# Altium project AWH6_V10.PrjPcb (part 2 of 3)

## Sheet TF-USB.SchDoc
size A3; SheetNumber: 9; SheetTotal: 10
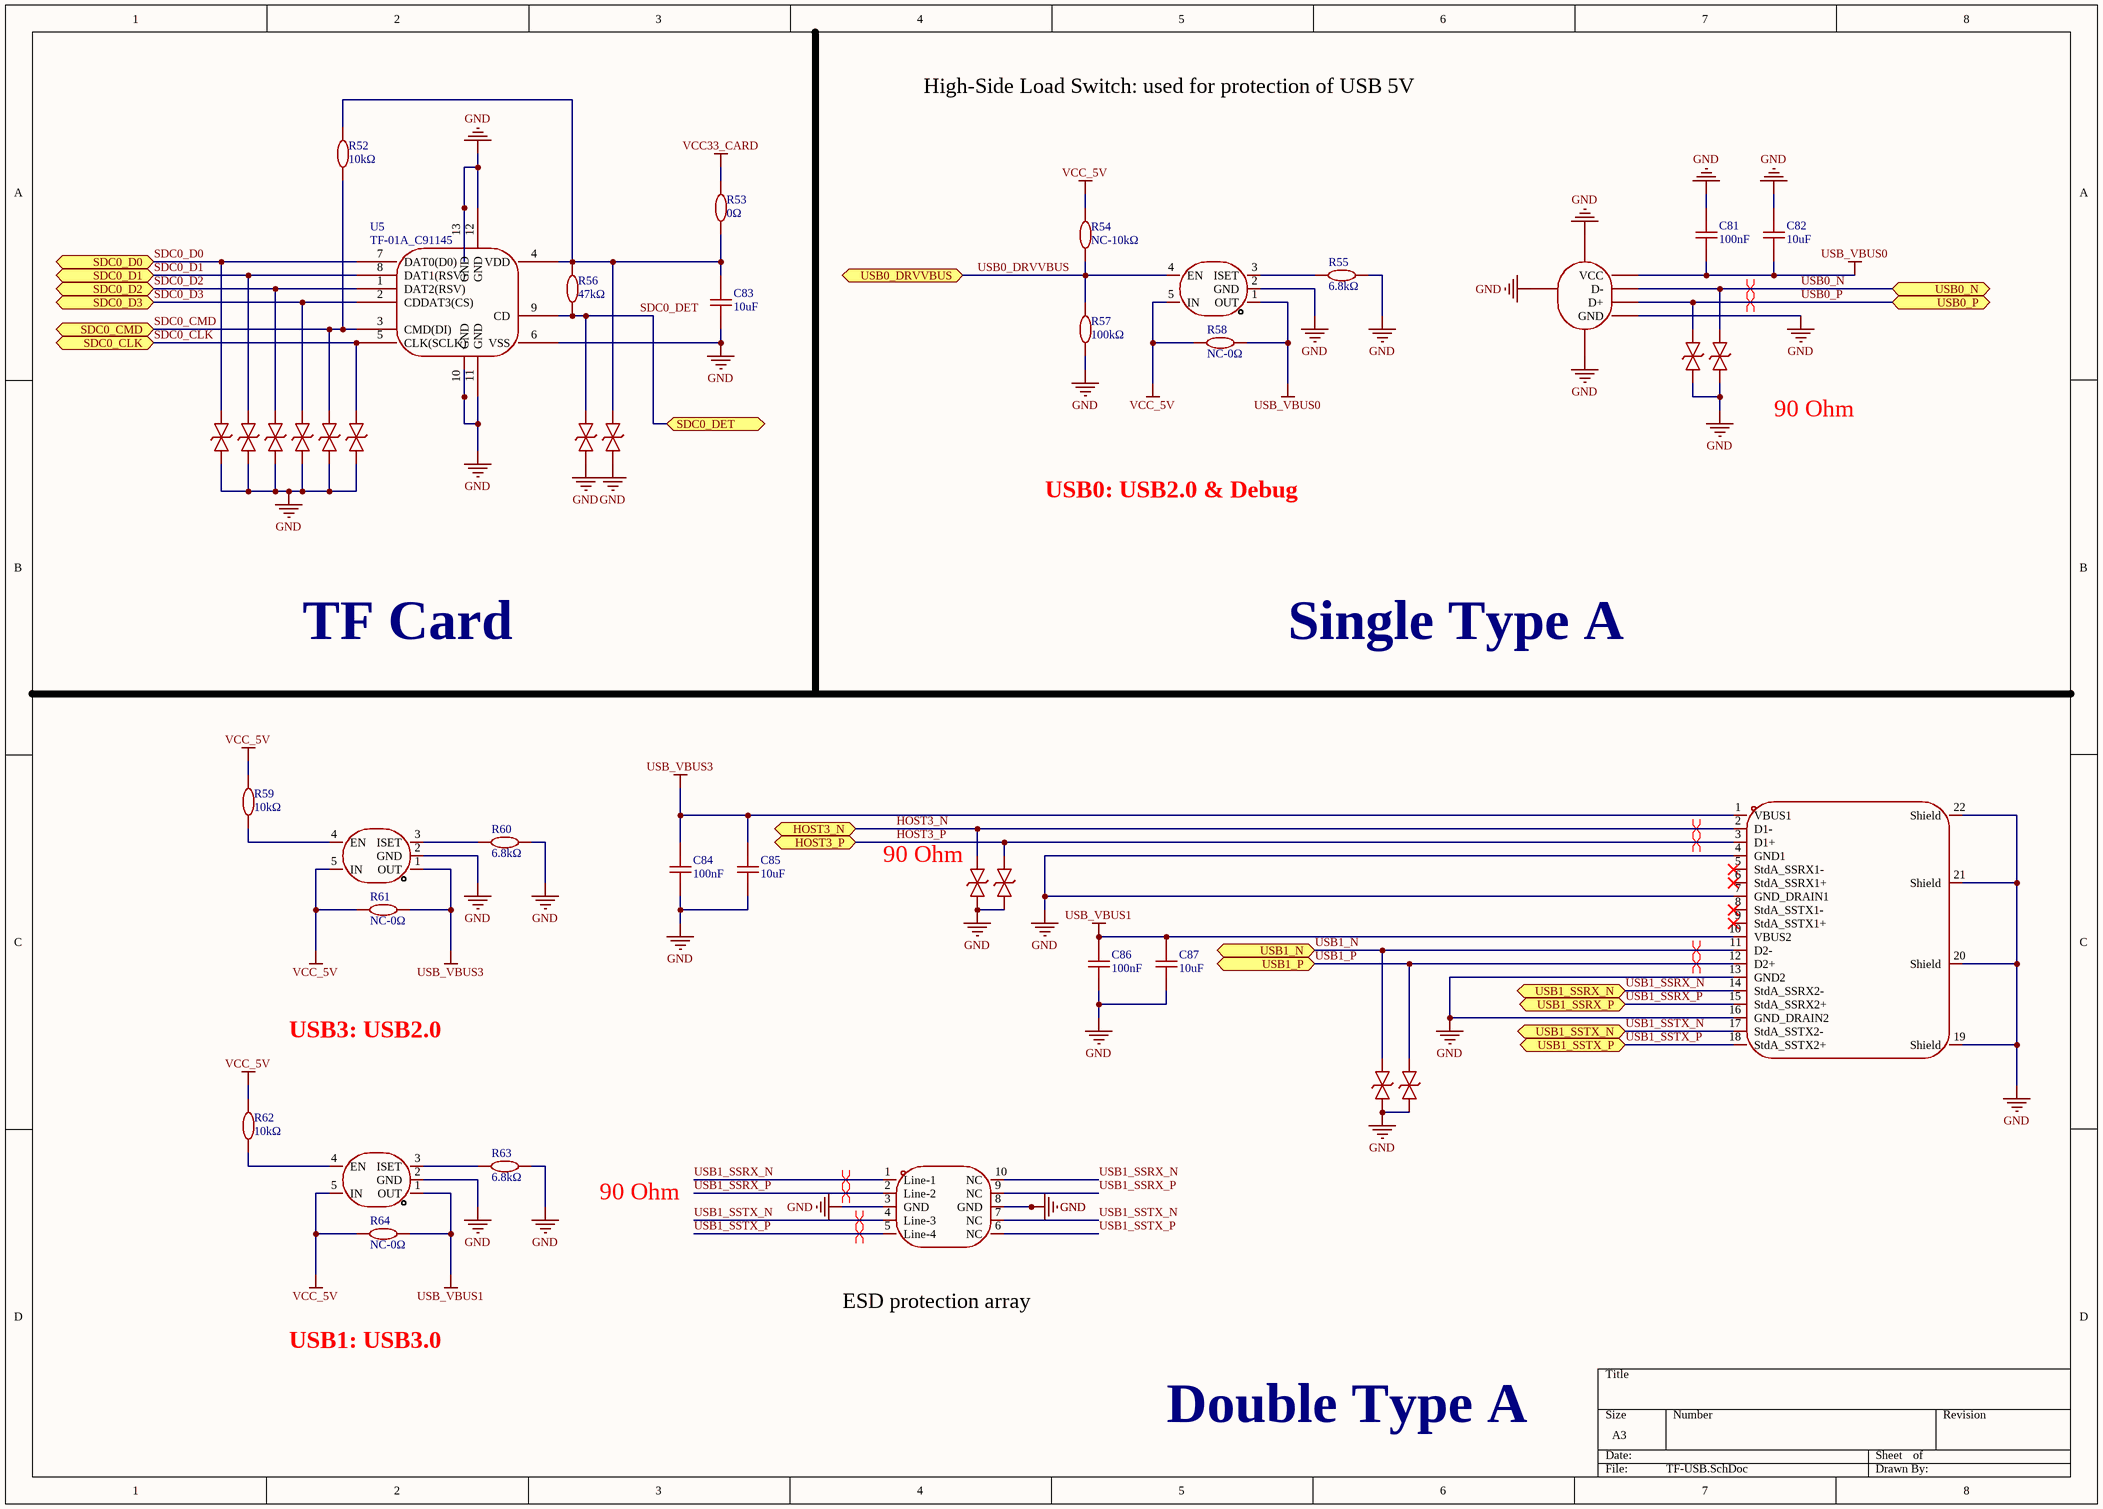
[diagram p5: TF-USB.SchDoc]

### Parts
C81  100nF  [C0402]
C82  10uF  [C0603]
C83  10uF  [C0603]
C84  100nF  [C0402]
C85  10uF  [C0603]
C86  100nF  [C0402]
C87  10uF  [C0603]
D6  AZ1045-04F.R7G  [DFN2510-10_L2.5-W1.0-P0.50-BL]  (value not drawn)
R52  10kΩ  [R0402]
R53  0Ω  [R0402]
R54  NC-10kΩ  [R0402]
R55  6.8kΩ  [R0402]
R56  47kΩ  [R0402]
R57  100kΩ  [R0402]
R58  NC-0Ω  [R0402]
R59  10kΩ  [R0402]
R60  6.8kΩ  [R0402]
R61  NC-0Ω  [R0402]
R62  10kΩ  [R0402]
R63  6.8kΩ  [R0402]
R64  NC-0Ω  [R0402]
U5  TF-01A_C91145  [TF-SMD_TF-01A]
U13  SY6280AAC  [SOT-23-5_L3.0-W1.7-P0.95-LS2.8-BL]  (value not drawn)
U14  ESD5451N  [DFN1006-2L-BI]  (value not drawn)
U15  ESD5451N  [DFN1006-2L-BI]  (value not drawn)
U16  ESD5451N  [DFN1006-2L-BI]  (value not drawn)
U17  ESD5451N  [DFN1006-2L-BI]  (value not drawn)
U18  ESD5451N  [DFN1006-2L-BI]  (value not drawn)
U19  ESD5451N  [DFN1006-2L-BI]  (value not drawn)
U20  ESD5451N  [DFN1006-2L-BI]  (value not drawn)
U21  ESD5451N  [DFN1006-2L-BI]  (value not drawn)
U22  ESD5451N  [DFN1006-2L-BI]  (value not drawn)
U23  ESD5451N  [DFN1006-2L-BI]  (value not drawn)
U24  ESD5451N  [DFN1006-2L-BI]  (value not drawn)
U25  ESD5451N  [DFN1006-2L-BI]  (value not drawn)
U26  SY6280AAC  [SOT-23-5_L3.0-W1.7-P0.95-LS2.8-BL]  (value not drawn)
U27  ESD5451N  [DFN1006-2L-BI]  (value not drawn)
U28  ESD5451N  [DFN1006-2L-BI]  (value not drawn)
U29  SY6280AAC  [SOT-23-5_L3.0-W1.7-P0.95-LS2.8-BL]  (value not drawn)
USB1  USB-303WSD-BRY  [USB-A-TH_XUNPU_USB-303WSD-BRY]  (value not drawn)
USB2  906-162A1011D10200  [USB-A-TH_4P-P1.40-V-F-C39416]  (value not drawn)

### Ports
HOST3_N (bidir, see SoC_2[2A]), HOST3_P (bidir, see SoC_2[2A]), SDC0_CLK (bidir, see SoC_1[7A]), SDC0_CMD (bidir, see SoC_1[6A]), SDC0_D0 (bidir, see SoC_1[6A]), SDC0_D1 (bidir, see SoC_1[6A]), SDC0_D2 (bidir, see SoC_1[6A]), SDC0_D3 (bidir, see SoC_1[6A]), SDC0_DET (bidir, see SoC_1[6A]), USB0_DRVVBUS (bidir, see SoC_1[6C]), USB0_N (bidir, see SoC_2[2A]), USB0_P (bidir, see SoC_2[2A]), USB1_N (bidir, see SoC_2[2A]), USB1_P (bidir, see SoC_2[2A]), USB1_SSRX_N (bidir, see SoC_2[2A]), USB1_SSRX_P (bidir, see SoC_2[2A]), USB1_SSTX_N (bidir, see SoC_2[1A]), USB1_SSTX_P (bidir, see SoC_2[1A])

### Nets
GND: C81.2 C82.2 C83.1 C84.1 C85.1 C86.1 C87.1 D6.3(GND) D6.8(GND) R55.2 R57.1 R60.2 R63.2 U5.6(VSS) U5.10(GND) U5.11(GND) U5.12(GND) U5.13(GND) U13.2(GND) U14.1 U15.1 U16.1 U17.1 U18.1 U19.1 U20.1 U21.1 U22.1 U23.1 U24.1 U25.1 U26.2(GND) U27.1 U28.1 U29.2(GND) USB1.4(GND1) USB1.7(GND_DRAIN1) USB1.13(GND2) USB1.16(GND_DRAIN2) USB1.19(Shield) USB1.20(Shield) USB1.21(Shield) USB1.22(Shield) USB2.4(GND) USB2.5 USB2.6 USB2.7
USB_VBUS0: C81.1 C82.1 R58.1 U13.1(OUT) USB2.1(VCC)
USB_VBUS1: C86.2 C87.2 R64.1 U29.1(OUT) USB1.10(VBUS2)
USB_VBUS3: C84.2 C85.2 R61.1 U26.1(OUT) USB1.1(VBUS1)
VCC33_CARD: R53.2  [project net ALDO3]
VCC_5V: R54.2 R58.2 R59.2 R61.2 R62.2 R64.2 U13.5(IN) U26.5(IN) U29.5(IN)  [project net PS]
HOST3_N: U24.2 USB1.2(D1-) ; port HOST3_N
HOST3_P: U25.2 USB1.3(D1+) ; port HOST3_P
SDC0_CLK: U5.5(CLK(SCLK)) U21.2 ; port SDC0_CLK
SDC0_CMD: R52.1 U5.3(CMD(DI)) U20.2 ; port SDC0_CMD
SDC0_D0: U5.7(DAT0(D0)) U16.2 ; port SDC0_D0
SDC0_D1: U5.8(DAT1(RSV)) U17.2 ; port SDC0_D1
SDC0_D2: U5.1(DAT2(RSV)) U18.2 ; port SDC0_D2
SDC0_D3: U5.2(CDDAT3(CS)) U19.2 ; port SDC0_D3
SDC0_DET: R56.1 U5.9(CD) U22.2 ; port SDC0_DET
USB0_DRVVBUS: R54.1 R57.2 U13.4(EN) ; port USB0_DRVVBUS
USB0_N: U15.2 USB2.2(D-) ; port USB0_N
USB0_P: U14.2 USB2.3(D+) ; port USB0_P
USB1_N: U27.2 USB1.11(D2-) ; port USB1_N
USB1_P: U28.2 USB1.12(D2+) ; port USB1_P
USB1_SSRX_N: D6.1(Line-1) D6.10(NC) USB1.14(StdA_SSRX2-) ; port USB1_SSRX_N
USB1_SSRX_P: D6.2(Line-2) D6.9(NC) USB1.15(StdA_SSRX2+) ; port USB1_SSRX_P
USB1_SSTX_N: D6.4(Line-3) D6.7(NC) USB1.17(StdA_SSTX2-) ; port USB1_SSTX_N
USB1_SSTX_P: D6.5(Line-4) D6.6(NC) USB1.18(StdA_SSTX2+) ; port USB1_SSTX_P
NetC83_2: C83.2 R52.2 R53.1 R56.2 U5.4(VDD) U23.2
NetR55_1: R55.1 U13.3(ISET)
NetR59_1: R59.1 U26.4(EN)
NetR60_1: R60.1 U26.3(ISET)
NetR62_1: R62.1 U29.4(EN)
NetR63_1: R63.1 U29.3(ISET)

Not connected (* = marked no-connect by the designer): USB1 5(StdA_SSRX1-)* 6(StdA_SSRX1+)* 8(StdA_SSTX1-)* 9(StdA_SSTX1+)*

### Layout directives
differential pair: HOST3_N, HOST3_P, USB0_N, USB0_P, USB1_N, USB1_P, USB1_SSRX_N, USB1_SSRX_P, USB1_SSTX_N, USB1_SSTX_P

### Notes on the sheet
- High-Side Load Switch: used for protection of USB 5V
- 90 Ohm
- USB0: USB2.0 & Debug
- TF Card
- Single Type A
- (near U24) 90 Ohm
- USB3: USB2.0
- ESD protection array
- USB1: USB3.0
- Double Type A

### Library data of the parts
C81 C84 C86 = 100nF: 50V 100nF X7R ±10% 0402 Ceramic Capacitors ROHS
C82 C83 C85 C87 = 10uF: 10V 10uF X5R ±10% 0603 Ceramic Capacitors ROHS
D6 = AZ1045-04F.R7G: 3.5A@8/20us 30W@8/20us 12V 6V 5V DFN2510-10 TVS Diodes ROHS; Manufacturer: AMAZING(晶焱); Add into BOM: yes; Reverse Leakage Current (Ir): 1.5uA; Number of Channels: 4; level of protection: IEC 61000-4-5；IEC 61000-4-2; Type: ESD; Junction Capacitance: 0.5pF; Symbol: AZ1045-04F.R7G; Device: AZ1045-04F.R7G; LCSC Part Name: ESD 5V截止 峰值脉冲电流：3.5A@8/20us; Supplier Part: C356811; Manufacturer Part: AZ1045-04F.R7G; Supplier Footprint: DFN2510-10; JLCPCB Part Class: Extended Part; Datasheet: https://item.szlcsc.com/datasheet/AZ1045-04F.R7G/331915.html; Supplier: LCSC; Convert to PCB: yes; Reverse Stand-Off Voltage (Vrwm): 5V; Clamping Voltage: 12V; Peak Pulse Current (Ipp): 3.5A@8/20us; Peak Pulse Power Dissipation (Ppp): 30W@8/20us; Voltage - Breakdown: 6V
R52 R54 R59 R62 = 10kΩ: 62.5mW 10kΩ 50V ±100ppm/℃ Thick Film Resistor ±1% 0402 Chip Resistor - Surface Mount ROHS
R53 R58 R61 R64 = 0Ω: 0Ω 62.5mW 50V Thick Film Resistor ±1% 0402 Chip Resistor - Surface Mount ROHS
R55 R60 R63 = 6.8kΩ: 62.5mW 6.8kΩ 50V ±100ppm/℃ Thick Film Resistor ±1% 0402 Chip Resistor - Surface Mount ROHS
R56 = 47kΩ: 62.5mW 47kΩ 50V ±100ppm/℃ Thick Film Resistor ±1% 0402 Chip Resistor - Surface Mount ROHS
R57 = 100kΩ: 100kΩ 62.5mW 50V ±100ppm/℃ Thick Film Resistor ±1% 0402 Chip Resistor - Surface Mount ROHS
U5 = TF-01A_C91145: Push-Push 1.85mm Connector and Ejector MicroSD Card (TF Card) SMD PC Card Sockets ROHS
U13 U26 U29 = SY6280AAC_C55136: 1 Active High High Side Switch SOT-23-5 Power Distribution Switches, Load Drivers ROHS; Manufacturer: Silergy(矽力杰); Add into BOM: yes; Number of Channels: 1; Voltage - Supply: 2.4V~5.5V; RDS(on): 80mΩ; Symbol: SY6280AAC; Device: SY6280AAC_C55136; LCSC Part Name: SY6280AAC; Supplier Part: C55136; Manufacturer Part: SY6280AAC; Supplier Footprint: SOT-23-5; JLCPCB Part Class: Extended Part; Datasheet: https://item.szlcsc.com/datasheet/SY6280AAC/56162.html; Supplier: LCSC; Convert to PCB: yes; Type: High Side Switch; Control Input Logic: Active High; Operating Temperature	-: -40℃~+125℃; Features: Over Temperature Protection；Overcurrent Protection(OCP)
U14-U25 U27 U28 = ESD5451N_C5261080: 9A 9.8V 8V Bidirectional 5V DFN1006-2L TVS Diodes ROHS; Manufacturer: HXY MOSFET(华轩阳电子); Add into BOM: yes; Reverse Leakage Current (Ir): 500nA; Number of Channels: 1.0; level of protection: IEC 61000-4-2; Junction Capacitance: 15pF; Symbol: ESD5451N_C5261080; Device: ESD5451N_C5261080; LCSC Part Name: 5V 15pF 双向; Supplier Part: C5261080; Manufacturer Part: ESD5451N; Supplier Footprint: DFN1006-2L; JLCPCB Part Class: Extended Part; Datasheet: https://item.szlcsc.com/datasheet/ESD5451N/5983779.html; Supplier: LCSC; Convert to PCB: yes; Polarity: Bidirectional; Reverse Stand-Off Voltage (Vrwm): 5V; Clamping Voltage: 9.8V; Peak Pulse Current (Ipp): 9A; Voltage - Breakdown: 8V; Type: ESD
USB1 = USB-303WSD-BRY: USB 3.0 2 9Px2 -30℃~+85℃ Type-A Through Hole,Right Angle USB, DVI, HDMI Connector Assemblies ROHS; Manufacturer: XUNPU(讯普); Add into BOM: yes; Protocol Standard: USB 3.0; Gender: Female; Number of Ports: 2; Current Rating-Power: 1.8A; Voltage Rating: 30V; Detection color: Blue; Symbol: USB-303WSD-BRY; Device: USB-303WSD-BRY; Supplier Part: C2895028; Manufacturer Part: USB-303WSD-BRY; Supplier Footprint: 插件; JLCPCB Part Class: Extended Part; Datasheet: https://item.szlcsc.com/datasheet/USB-303WSD-BRY/3132965.html; Supplier: LCSC; Convert to PCB: yes; Connector Type: Type-A; Mounting Type: Right Angle; Number of Contacts: 9Px2; Length: -; Operating Temperature: -30℃~+85℃; LCSC Part Name: Type-A 母 弯插
USB2 = 906-162A1011D10200: USB 2.0 1 4P Type-A Through Hole USB, DVI, HDMI Connector Assemblies ROHS; Manufacturer: 精拓金; Symbol: AFSide of the three straight feet boundless copper14.0PBTWhite plastic90degree; Add into BOM: yes; Protocol Standard: USB 2.0; Gender: Female; Number of Ports: 1; Current Rating-Power: 2A; Device: 906-162A1011D10200; LCSC Part Name: Type-A 母 侧插; Supplier Part: C39417; Manufacturer Part: 906-162A1011D10200; Supplier Footprint: 插件; JLCPCB Part Class: Extended Part; Datasheet: https://item.szlcsc.com/datasheet/906-162A1011D10200/40400.html; Supplier: LCSC; Convert to PCB: yes; Connector Type: Type-A; Mounting Type: Vertical, Flag; Number of Contacts: 4P; Operating Temperature: -

## Sheet Audio-HDMI.SchDoc
size A3; SheetNumber: 3; SheetTotal: 10
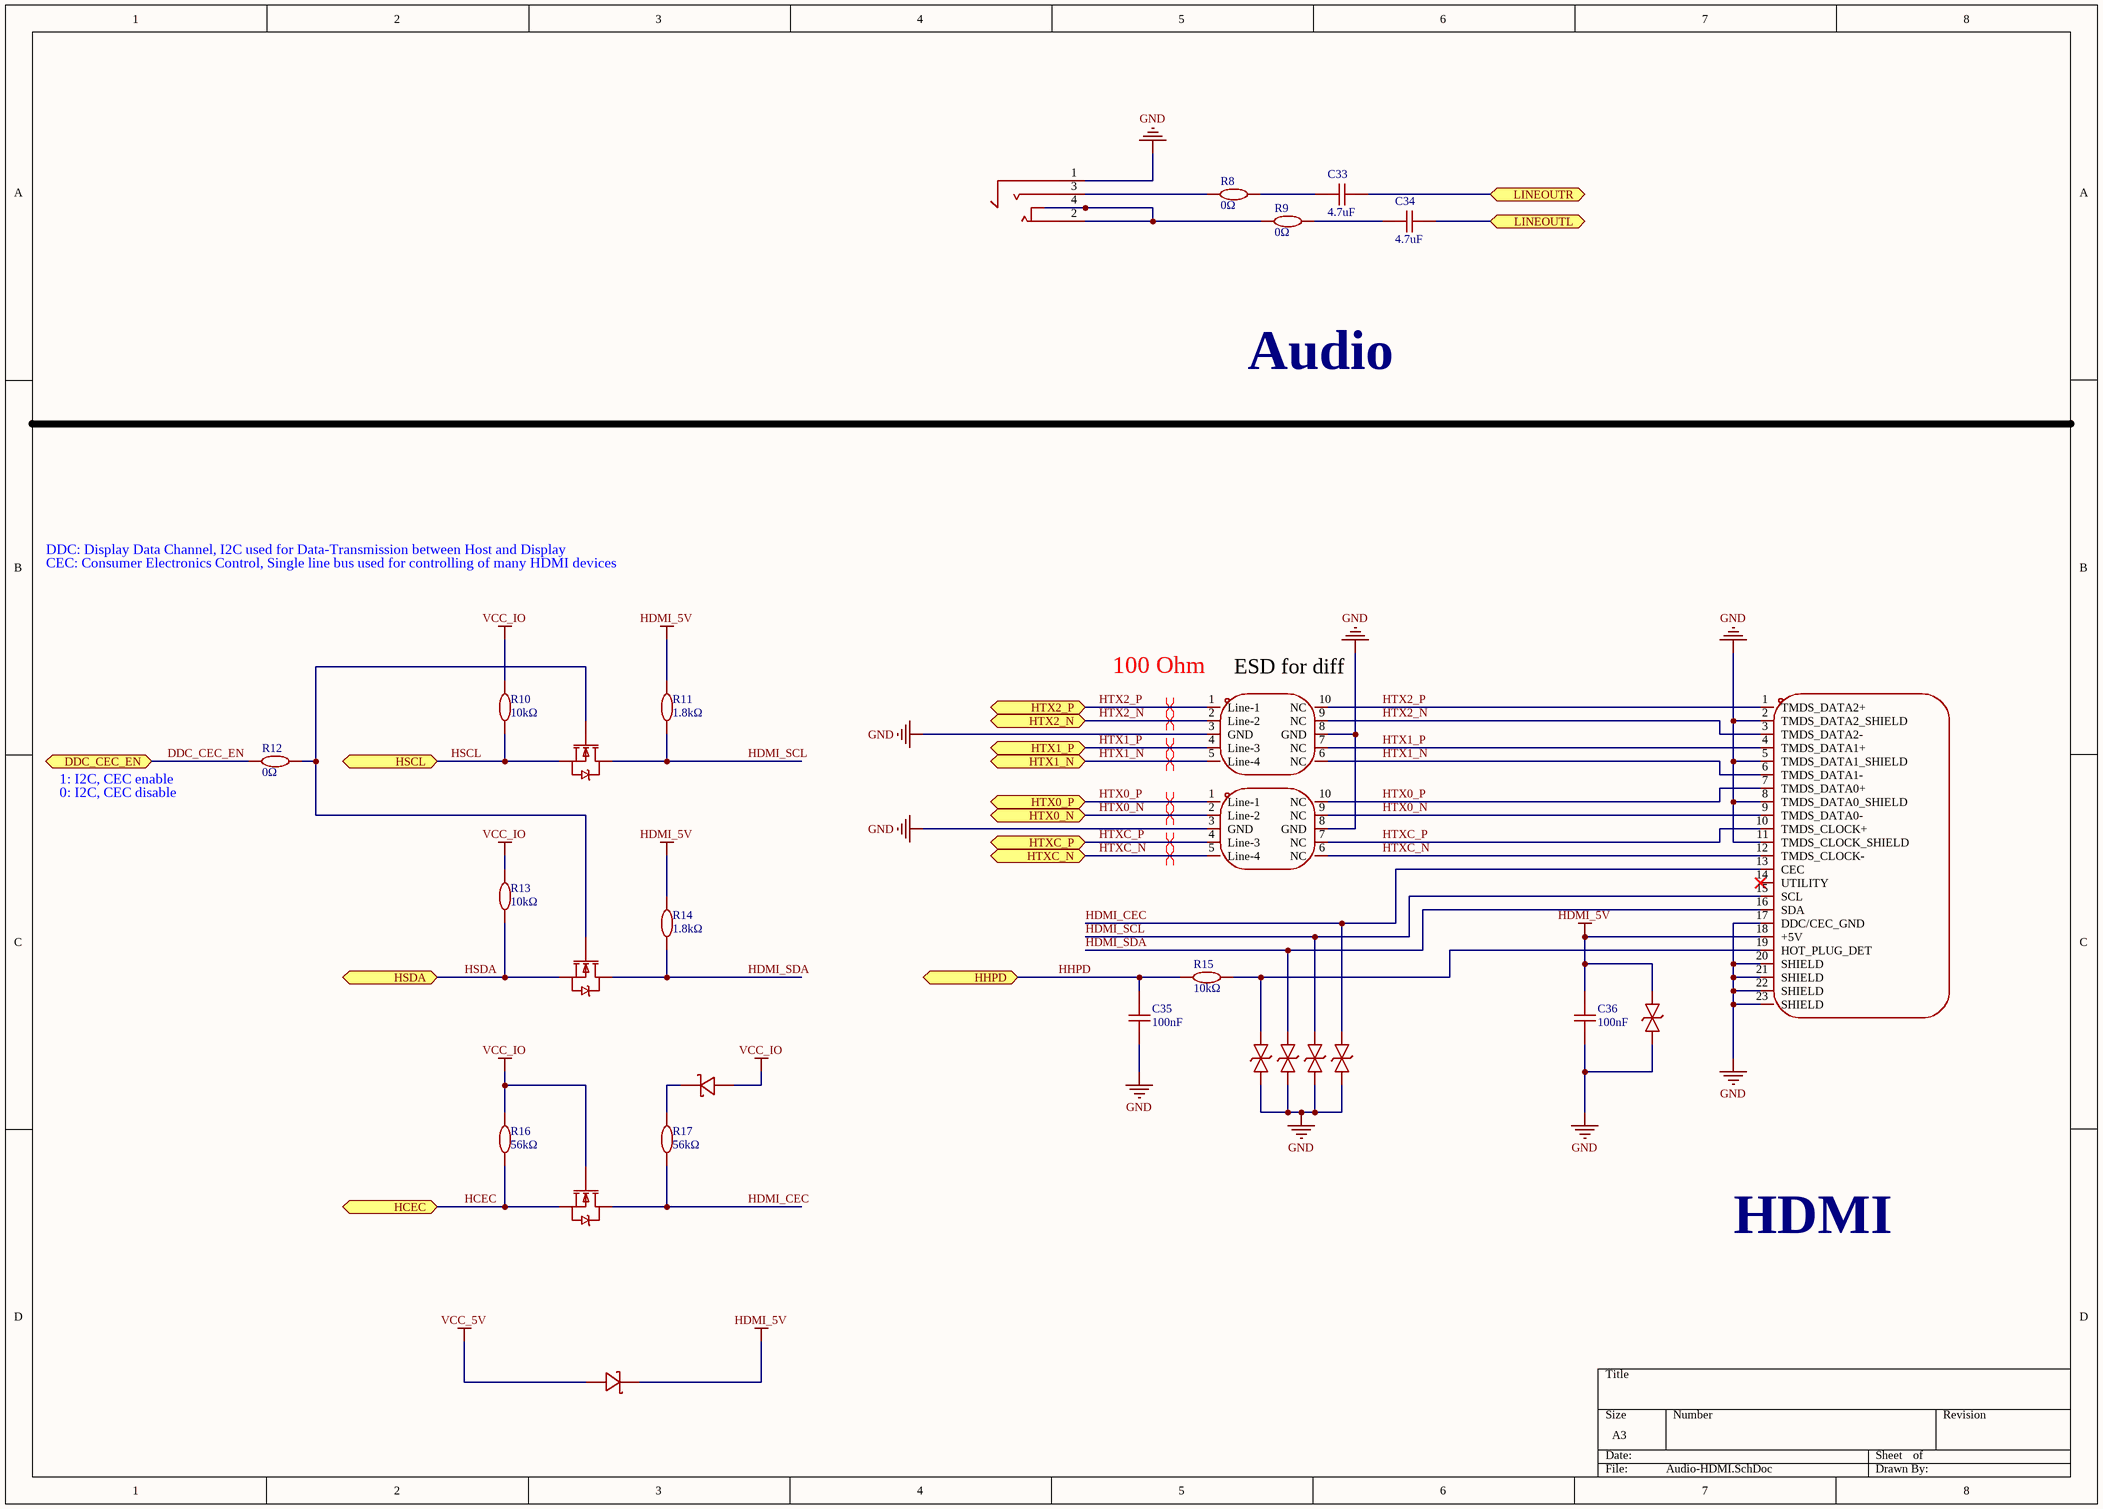
[diagram p6: Audio-HDMI.SchDoc]

### Parts
AUDIO1  PJ-327C-4A  [AUDIO-SMD_PJ-327C-4A]  (value not drawn)
C33  4.7uF  [C0402]
C34  4.7uF  [C0402]
C35  100nF  [C0402]
C36  100nF  [C0402]
CN1  KH-HDMI-19P-Cu  [HDMI-SMD_KH-HDMI-19P-CU]  (value not drawn)
D1  AZ1045-04F.R7G  [DFN2510-10_L2.5-W1.0-P0.50-BL]  (value not drawn)
D2  AZ1045-04F.R7G  [DFN2510-10_L2.5-W1.0-P0.50-BL]  (value not drawn)
D3  1N5819WS  [SOD-323_L1.8-W1.3-LS2.5-RD]  (value not drawn)
D4  1N5819WS  [SOD-323_L1.8-W1.3-LS2.5-RD]  (value not drawn)
Q1  BSN20  [SOT-23-3_L2.9-W1.6-P1.90-LS2.8-BR]  (value not drawn)
Q2  BSN20  [SOT-23-3_L2.9-W1.6-P1.90-LS2.8-BR]  (value not drawn)
Q3  BSN20  [SOT-23-3_L2.9-W1.6-P1.90-LS2.8-BR]  (value not drawn)
R8  0Ω  [R0402]
R9  0Ω  [R0402]
R10  10kΩ  [R0402]
R11  1.8kΩ  [R0402]
R12  0Ω  [R0402]
R13  10kΩ  [R0402]
R14  1.8kΩ  [R0402]
R15  10kΩ  [R0402]
R16  56kΩ  [R0402]
R17  56kΩ  [R0402]
U7  ESD5451N  [DFN1006-2L-BI]  (value not drawn)
U8  ESD5451N  [DFN1006-2L-BI]  (value not drawn)
U9  ESD5451N  [DFN1006-2L-BI]  (value not drawn)
U10  ESD5451N  [DFN1006-2L-BI]  (value not drawn)
U11  ESD5451N  [DFN1006-2L-BI]  (value not drawn)

### Ports
DDC_CEC_EN (bidir, see SoC_1[6B]), HCEC (bidir, see SoC_1[6C]), HHPD (bidir, see SoC_2[2B]), HSCL (bidir, see SoC_1[6B]), HSDA (bidir, see SoC_1[6B]), HTX0_N (bidir, see SoC_2[2B]), HTX0_P (bidir, see SoC_2[2B]), HTX1_N (bidir, see SoC_2[2B]), HTX1_P (bidir, see SoC_2[2B]), HTX2_N (bidir, see SoC_2[2B]), HTX2_P (bidir, see SoC_2[2B]), HTXC_N (bidir, see SoC_2[2B]), HTXC_P (bidir, see SoC_2[2B]), LINEOUTL (bidir, see SoC_2[4B]), LINEOUTR (bidir, see SoC_2[4B])

### Nets
GND: AUDIO1.1 C35.1 C36.1 CN1.2(TMDS_DATA2_SHIELD) CN1.5(TMDS_DATA1_SHIELD) CN1.8(TMDS_DATA0_SHIELD) CN1.11(TMDS_CLOCK_SHIELD) CN1.17(DDC/CEC_GND) CN1.20(SHIELD) CN1.21(SHIELD) CN1.22(SHIELD) CN1.23(SHIELD) D1.3(GND) D1.8(GND) D2.3(GND) D2.8(GND) U7.1 U8.1 U9.1 U10.1 U11.1
HDMI_5V: C36.2 CN1.18(+5V) D4.1(K) R11.2 R14.2 U7.2
VCC_5V: D4.2(A)  [project net PS]
VCC_IO: D3.2(A) Q3.1(G) R10.2 R13.2 R16.2  [project net ALDO3]
DDC_CEC_EN: R12.1 ; port DDC_CEC_EN
HCEC: Q3.2(S) R16.1 ; port HCEC
HDMI_CEC: CN1.13(CEC) Q3.3(D) R17.1 U11.2
HDMI_SCL: CN1.15(SCL) Q1.3(D) R11.1 U10.2
HDMI_SDA: CN1.16(SDA) Q2.3(D) R14.1 U9.2
HHPD: C35.2 R15.1 ; port HHPD
HSCL: Q1.2(S) R10.1 ; port HSCL
HSDA: Q2.2(S) R13.1 ; port HSDA
HTX0_N: CN1.9(TMDS_DATA0-) D2.2(Line-2) D2.9(NC) ; port HTX0_N
HTX0_P: CN1.7(TMDS_DATA0+) D2.1(Line-1) D2.10(NC) ; port HTX0_P
HTX1_N: CN1.6(TMDS_DATA1-) D1.5(Line-4) D1.6(NC) ; port HTX1_N
HTX1_P: CN1.4(TMDS_DATA1+) D1.4(Line-3) D1.7(NC) ; port HTX1_P
HTX2_N: CN1.3(TMDS_DATA2-) D1.2(Line-2) D1.9(NC) ; port HTX2_N
HTX2_P: CN1.1(TMDS_DATA2+) D1.1(Line-1) D1.10(NC) ; port HTX2_P
HTXC_N: CN1.12(TMDS_CLOCK-) D2.5(Line-4) D2.6(NC) ; port HTXC_N
HTXC_P: CN1.10(TMDS_CLOCK+) D2.4(Line-3) D2.7(NC) ; port HTXC_P
LINEOUTL: C34.2 ; port LINEOUTL
LINEOUTR: C33.2 ; port LINEOUTR
NetAUDIO1_2: AUDIO1.2 AUDIO1.4 R9.1
NetAUDIO1_3: AUDIO1.3 R8.1
NetC33_1: C33.1 R8.2
NetC34_1: C34.1 R9.2
NetCN1_19: CN1.19(HOT_PLUG_DET) R15.2 U8.2
NetD3_1: D3.1(K) R17.2
NetQ1_1: Q1.1(G) Q2.1(G) R12.2

Not connected (* = marked no-connect by the designer): CN1 14(UTILITY)*

### Layout directives
differential pair: HTX0_N, HTX0_P, HTX1_N, HTX1_P, HTX2_N, HTX2_P, HTXC_N, HTXC_P

### Notes on the sheet
- Audio
- DDC: Display Data Channel, I2C used for Data-Transmission between Host and Display
- CEC: Consumer Electronics Control, Single line bus used for controlling of many HDMI devices
- (near D1) 100 Ohm
- (near D1) ESD for diff
- 1: I2C, CEC enable
- 0: I2C, CEC disable
- HDMI

### Library data of the parts
AUDIO1 = PJ-327C-4A: 3.5mm Headphone Jack 30V 500mA SMD Audio Connectors ROHS; Manufacturer: 韩国韩荣; Add into BOM: yes; Symbol: PJ-327C-4A; Device: PJ-327C-4A; LCSC Part Name: 3.5mm耳机座; Supplier Part: C145813; Manufacturer Part: PJ-327C-4A; Supplier Footprint: SMD; JLCPCB Part Class: Extended Part; Datasheet: https://item.szlcsc.com/datasheet/PJ-327C-4A/157145.html; Supplier: LCSC; Convert to PCB: yes; Connector Type: 3.5mm Headphone Jack; Current Rating: 500mA; Voltage Rating (Max): 30V
C33 C34 = 4.7uF: 10V 4.7uF X5R ±20% 0402 Ceramic Capacitors ROHS
C35 C36 = 100nF: as C81 on sheet TF-USB
CN1 = KH-HDMI-19P-Cu: HDMI-A SMD USB, DVI, HDMI Connector Assemblies ROHS; Manufacturer: kinghelm(金航标); Add into BOM: yes; Gender: Mother; Symbol: KH-HDMI-19P-CU; Device: KH-HDMI-19P-Cu; LCSC Part Name: KH-HDMI-19P-Cu; Supplier Part: C709361; Manufacturer Part: KH-HDMI-19P-Cu; Supplier Footprint: SMD; JLCPCB Part Class: Extended Part; Datasheet: https://atta.szlcsc.com/upload/public/pdf/source/20211208/D47DE7411E98B8CA58BDDFA754B04DEC.pdf; Supplier: LCSC; Convert to PCB: yes; Connector Type: HDMI-A; Number of Pins: 19P; Mounting Style: Horizontal attachment; Current Rating (Max): -; Rated Voltage (Max): -; Operating Temperature Range: -
D1 D2 = AZ1045-04F.R7G: as D6 on sheet TF-USB; Symbol: AZ1045-04F.R7G; Device: AZ1045-04F.R7G; LCSC Part Name: ESD 5V截止 峰值脉冲电流：3.5A@8/20us; Supplier Part: C356811; Manufacturer Part: AZ1045-04F.R7G; Supplier Footprint: DFN2510-10; JLCPCB Part Class: Extended Part; Datasheet: https://item.szlcsc.com/datasheet/AZ1045-04F.R7G/331915.html; Supplier: LCSC; Convert to PCB: yes; Reverse Stand-Off Voltage (Vrwm): 5V; Clamping Voltage: 12V; Peak Pulse Current (Ipp): 3.5A@8/20us; Peak Pulse Power Dissipation (Ppp): 30W@8/20us; Voltage - Breakdown: 6V
D3 D4 = 1N5819WS_C191023: 25A 40V 600mV@1A 1A SOD-323 Single Diodes ROHS; Manufacturer: Hottech(合科泰); Add into BOM: yes; Symbol: 1N5819WS; Device: 1N5819WS_C191023; LCSC Part Name: 电压:40V 电流:1A; Supplier Part: C191023; Manufacturer Part: 1N5819WS; Supplier Footprint: SOD-323; JLCPCB Part Class: Basic Part; Datasheet: https://item.szlcsc.com/datasheet/1N5819WS/213850.html; Supplier: LCSC; Convert to PCB: yes; Voltage - Forward(Vf@If): 600mV@1A; Voltage - DC Reverse(Vr): 40V; Current - Rectified: 1A; Non-Repetitive Peak Forward Surge Current: 25A
Q1-Q3 = BSN20_C116157: 50V 100mA 10Ω@2.75V,0.2A 1.5V@250uA 1 N-Channel SOT-23 Single FETs, MOSFETs ROHS; Manufacturer: SHIKUES(时科); Add into BOM: yes; Number: 1个N沟道; Input Capacitance(Ciss): 40pF; Reverse Transfer Capacitance (Crss@Vds): 10pF; Type: N沟道; Output Capacitance(Coss): 15pF; Symbol: BSN20; Device: BSN20_C116157; LCSC Part Name: 1个N沟道 耐压:50V 电流:0.1A; Supplier Part: C116157; Manufacturer Part: BSN20; Supplier Footprint: SOT-23; JLCPCB Part Class: Extended Part; Datasheet: https://item.szlcsc.com/datasheet/BSN20/117410.html; Supplier: LCSC; Convert to PCB: yes; Drain to Source Voltage: 50V; Current - Continuous Drain(Id): 100mA; RDS(on): 10Ω@2.75V,0.2A; Pd - Power Dissipation: -; Gate Threshold Voltage (Vgs(th)): 1.5V@250uA
R8 R9 R12 = 0Ω: as R53 on sheet TF-USB
R10 R13 R15 = 10kΩ: as R52 on sheet TF-USB
R11 R14 = 1.8kΩ: 62.5mW 1.8kΩ 50V ±100ppm/℃ Thick Film Resistor ±1% 0402 Chip Resistor - Surface Mount ROHS
R16 R17 = 56kΩ: 56kΩ 62.5mW 50V ±100ppm/℃ Thick Film Resistor ±1% 0402 Chip Resistor - Surface Mount ROHS
U7-U11 = ESD5451N_C5261080: as U14 on sheet TF-USB; Symbol: ESD5451N_C5261080; Device: ESD5451N_C5261080; LCSC Part Name: 5V 15pF 双向; Supplier Part: C5261080; Manufacturer Part: ESD5451N; Supplier Footprint: DFN1006-2L; JLCPCB Part Class: Extended Part; Datasheet: https://item.szlcsc.com/datasheet/ESD5451N/5983779.html; Supplier: LCSC; Convert to PCB: yes; Polarity: Bidirectional; Reverse Stand-Off Voltage (Vrwm): 5V; Clamping Voltage: 9.8V; Peak Pulse Current (Ipp): 9A; Voltage - Breakdown: 8V; Type: ESD

## Sheet Wi-Fi.SchDoc
size A3; SheetNumber: 4; SheetTotal: 10
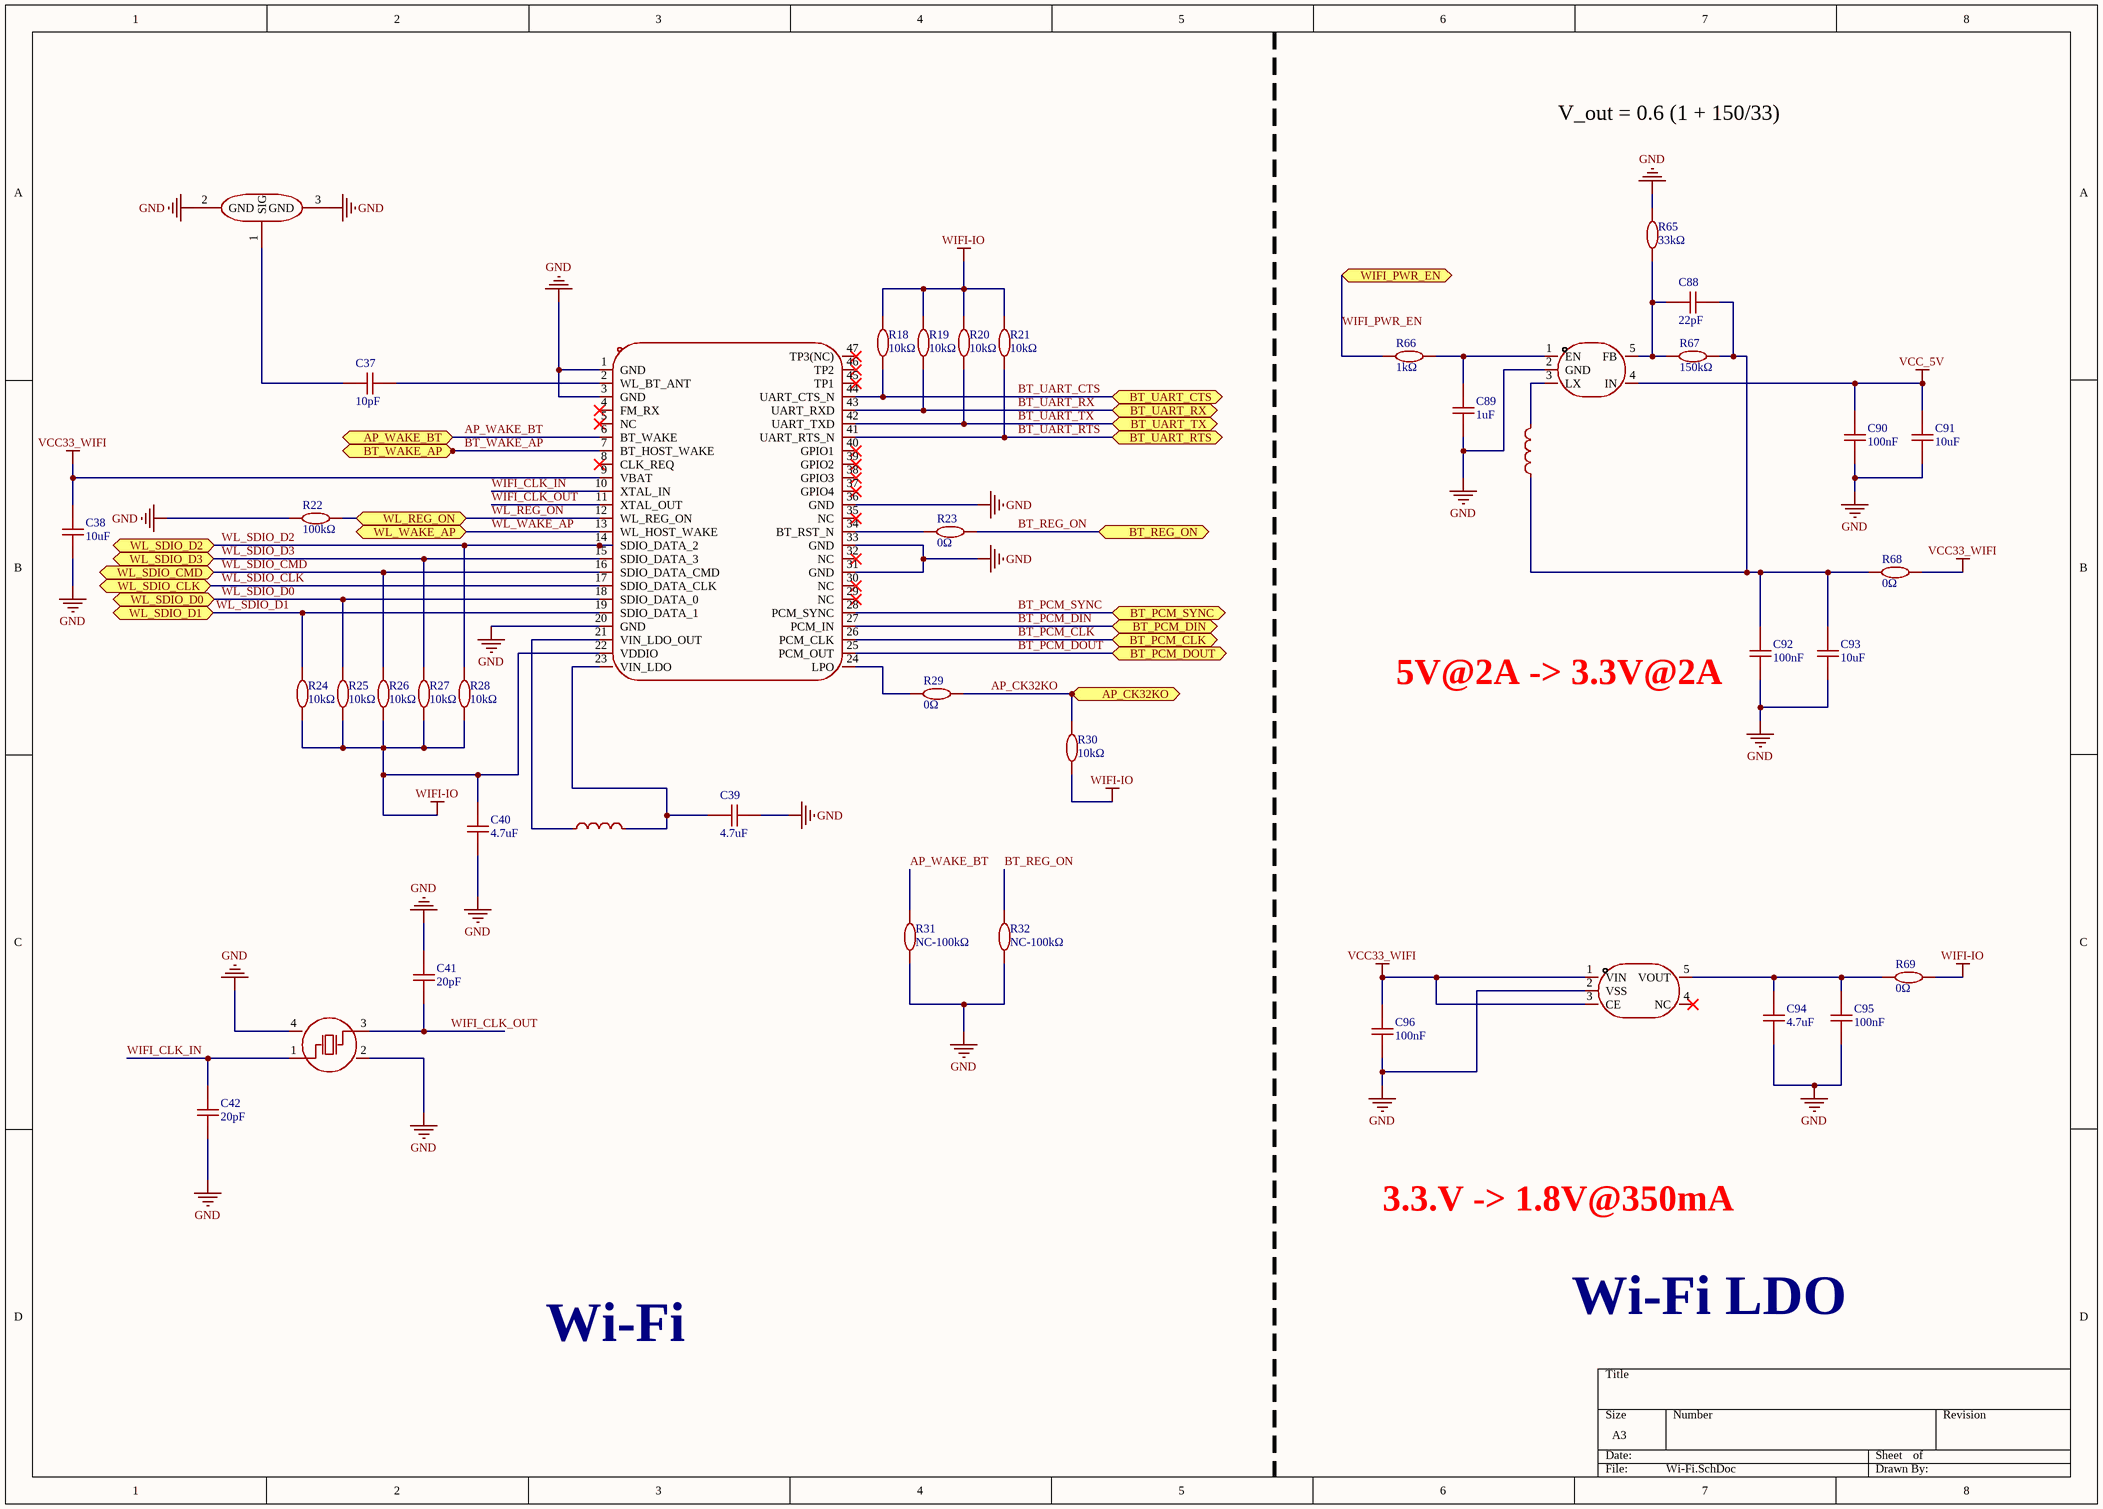
[diagram p7: Wi-Fi.SchDoc]

### Parts
C37  10pF  [C0402]
C38  10uF  [C0603]
C39  4.7uF  [C0402]
C40  4.7uF  [C0402]
C41  20pF  [C0402]
C42  20pF  [C0402]
C88  22pF  [C0402]
C89  1uF  [C0402]
C90  100nF  [C0402]
C91  10uF  [C0603]
C92  100nF  [C0402]
C93  10uF  [C0603]
C94  4.7uF  [C0402]
C95  100nF  [C0402]
C96  100nF  [C0402]
JP1  6GHz  [RF-SMD_FRF05002-JSS103M]  (value not drawn)
L1  4.7uH  [IND-SMD_L6.0-W6.0_FNR60XXS]  (value not drawn)
L7  4.7uH  [IND-SMD_L6.0-W6.0_FNR60XXS]  (value not drawn)
R18  10kΩ  [R0402]
R19  10kΩ  [R0402]
R20  10kΩ  [R0402]
R21  10kΩ  [R0402]
R22  100kΩ  [R0402]
R23  0Ω  [R0402]
R24  10kΩ  [R0402]
R25  10kΩ  [R0402]
R26  10kΩ  [R0402]
R27  10kΩ  [R0402]
R28  10kΩ  [R0402]
R29  0Ω  [R0402]
R30  10kΩ  [R0402]
R31  NC-100kΩ  [R0402]
R32  NC-100kΩ  [R0402]
R65  33kΩ  [R0402]
R66  1kΩ  [R0402]
R67  150kΩ  [R0402]
R68  0Ω  [R0402]
R69  0Ω  [R0402]
U6  2.4GHz  [QFN-44_L12.0-W12.0-P0.90-TL_AP6212]  (value not drawn)
U30  SY8089A1AAC  [TSOT-23-5_L2.9-W1.6-P0.95-LS2.8-BR]  (value not drawn)
U31  ME6212C18M5G  [SOT-23-5_L3.0-W1.7-P0.95-LS2.8-BL]  (value not drawn)
X1  26MHz  [CRYSTAL-SMD_4P-L3.2-W2.5-BL]  (value not drawn)

### Ports
AP_CK32KO (bidir, see SoC_2[4B]), AP_WAKE_BT (bidir, see SoC_1[6C]), BT_PCM_CLK (bidir, see SoC_1[6B]), BT_PCM_DIN (bidir, see SoC_1[6B]), BT_PCM_DOUT (bidir, see SoC_1[6B]), BT_PCM_SYNC (bidir, see SoC_1[6B]), BT_REG_ON (bidir, see SoC_1[6C]), BT_UART_CTS (bidir, see SoC_1[6B]), BT_UART_RTS (bidir, see SoC_1[6B]), BT_UART_RX (bidir, see SoC_1[6B]), BT_UART_TX (bidir, see SoC_1[6B]), BT_WAKE_AP (bidir, see SoC_1[6C]), WIFI_PWR_EN (bidir, see SoC_1[6B]), WL_REG_ON (bidir, see SoC_1[6C]), WL_SDIO_CLK (bidir, see SoC_1[7B]), WL_SDIO_CMD (bidir, see SoC_1[6B]), WL_SDIO_D0 (bidir, see SoC_1[6B]), WL_SDIO_D1 (bidir, see SoC_1[6B]), WL_SDIO_D2 (bidir, see SoC_1[6B]), WL_SDIO_D3 (bidir, see SoC_1[6B]), WL_WAKE_AP (bidir, see SoC_1[6C])

### Nets
GND: C38.1 C39.2 C40.1 C41.2 C42.1 C89.1 C90.1 C91.1 C92.1 C93.1 C94.1 C95.1 C96.1 JP1.2(GND) JP1.3(GND) R22.1 R31.1 R32.1 R65.2 U6.1(GND) U6.3(GND) U6.20(GND) U6.31(GND) U6.33(GND) U6.36(GND) U30.2(GND) U31.2(VSS) X1.2(GND) X1.4(GND)
VCC33_WIFI: C38.2 C96.2 R68.2 U6.9(VBAT) U31.1(VIN) U31.3(CE)
VCC_5V: C90.2 C91.2 U30.4(IN)  [project net PS]
WIFI-IO: C40.2 R18.2 R19.2 R20.2 R21.2 R24.1 R25.1 R26.1 R27.1 R28.1 R30.1 R69.2 U6.22(VDDIO)  [project net VCC_DCXOIO]
AP_CK32KO: R29.2 R30.2 ; port AP_CK32KO
AP_WAKE_BT: R31.2 U6.6(BT_WAKE) ; port AP_WAKE_BT
BT_PCM_CLK: U6.26(PCM_CLK) ; port BT_PCM_CLK
BT_PCM_DIN: U6.27(PCM_IN) ; port BT_PCM_DIN
BT_PCM_DOUT: U6.25(PCM_OUT) ; port BT_PCM_DOUT
BT_PCM_SYNC: U6.28(PCM_SYNC) ; port BT_PCM_SYNC
BT_REG_ON: R23.2 R32.2 ; port BT_REG_ON
BT_UART_CTS: R18.1 U6.44(UART_CTS_N) ; port BT_UART_CTS
BT_UART_RTS: R21.1 U6.41(UART_RTS_N) ; port BT_UART_RTS
BT_UART_RX: R19.1 U6.43(UART_RXD) ; port BT_UART_RX
BT_UART_TX: R20.1 U6.42(UART_TXD) ; port BT_UART_TX
BT_WAKE_AP: U6.7(BT_HOST_WAKE) ; port BT_WAKE_AP
WIFI_CLK_IN: C42.2 U6.10(XTAL_IN) X1.1(OSC1)
WIFI_CLK_OUT: C41.1 U6.11(XTAL_OUT) X1.3(OSC2)
WIFI_PWR_EN: R66.1 ; port WIFI_PWR_EN
WL_REG_ON: R22.2 U6.12(WL_REG_ON) ; port WL_REG_ON
WL_SDIO_CLK: U6.17(SDIO_DATA_CLK) ; port WL_SDIO_CLK
WL_SDIO_CMD: R26.2 U6.16(SDIO_DATA_CMD) ; port WL_SDIO_CMD
WL_SDIO_D0: R25.2 U6.18(SDIO_DATA_0) ; port WL_SDIO_D0
WL_SDIO_D1: R24.2 U6.19(SDIO_DATA_1) ; port WL_SDIO_D1
WL_SDIO_D2: R28.2 U6.14(SDIO_DATA_2) ; port WL_SDIO_D2
WL_SDIO_D3: R27.2 U6.15(SDIO_DATA_3) ; port WL_SDIO_D3
WL_WAKE_AP: U6.13(WL_HOST_WAKE) ; port WL_WAKE_AP
NetC37_1: C37.1 JP1.1(SIG)
NetC37_2: C37.2 U6.2(WL_BT_ANT)
NetC39_1: C39.1 L1.2 U6.23(VIN_LDO)
NetC88_1: C88.1 R65.1 R67.1 U30.5(FB)
NetC88_2: C88.2 C92.2 C93.2 L7.1 R67.2 R68.1
NetC89_2: C89.2 R66.2 U30.1(EN)
NetC94_2: C94.2 C95.2 R69.1 U31.5(VOUT)
NetL1_1: L1.1 U6.21(VIN_LDO_OUT)
NetL7_2: L7.2 U30.3(LX)
NetR23_1: R23.1 U6.34(BT_RST_N)
NetR29_1: R29.1 U6.24(LPO)

Not connected (* = marked no-connect by the designer): U6 4(FM_RX)* 5(NC)* 8(CLK_REQ)* 29(NC)* 30(NC)* 32(NC)* 35(NC)* 37(GPIO4)* 38(GPIO3)* 39(GPIO2)* 40(GPIO1)* 45(TP1)* 46(TP2)* 47(TP3(NC))*; U31 4(NC)*

### Notes on the sheet
- V_out = 0.6 (1 + 150/33)
- 5V@2A -> 3.3V@2A
- 3.3.V -> 1.8V@350mA
- Wi-Fi LDO
- Wi-Fi

### Library data of the parts
C37 = 10pF: 50V 10pF C0G ±5% 0402 Ceramic Capacitors ROHS
C38 C91 C93 = 10uF: as C82 on sheet TF-USB
C39 C40 C94 = 4.7uF: as C33 on sheet Audio-HDMI
C41 C42 = 20pF: 50V 20pF NP0 ±5% 0402 Ceramic Capacitors ROHS
C88 = 22pF: 50V 22pF C0G ±5% 0402 Ceramic Capacitors ROHS
C89 = 1uF: 50V 1uF X5R ±10% 0402 Ceramic Capacitors ROHS
C90 C92 C95 C96 = 100nF: as C81 on sheet TF-USB
JP1 = U.FL-R-SMT-1(80)_C88374: Manufacturer: HRS(广濑); Add into BOM: yes; Connector Type: Board Side; Interface: Male Pin; Number of Ports: 1; Interface Diameter: 2mm; Interface Length/Height: 1.25mm; RF Series: IPEX; Impedance: 50Ω; Symbol: U.FL-R-SMT-1(80); Device: U.FL-R-SMT-1(80)_C88374; LCSC Part Name: IPEX 内针; Supplier Part: C88374; Manufacturer Part: U.FL-R-SMT-1(80); Supplier Footprint: SMD; JLCPCB Part Class: Extended Part; Datasheet: https://item.szlcsc.com/datasheet/U.FL-R-SMT-1(80)/89553.html; Supplier: LCSC; Convert to PCB: yes; Value: 6GHz; Style: -; Operating Temperature Range: -40℃~+90℃
L1 L7 = FNR6020S4R7MT: 2.5A 4.7uH Magnetic Shielded Inductor ±20% 3.6A 75mΩ SMD,6x6mm Fixed Inductors ROHS; Manufacturer: cjiang(长江微电); Add into BOM: yes; Symbol: FNR6020S4R7MT; Device: FNR6020S4R7MT; LCSC Part Name: 4.7uH ±20% 3.6A; Supplier Part: C168008; Manufacturer Part: FNR6020S4R7MT; Supplier Footprint: SMD,6x6mm; JLCPCB Part Class: Extended Part; Datasheet: https://atta.szlcsc.com/upload/public/pdf/source/20190327/C167925_9EFF0AABC4CA629C2CC95961DBF7D39D.pdf; Supplier: LCSC; Convert to PCB: yes; Value: 4.7uH; Tolerance: ±20%; Saturation Current (Isat): 3.6A; DC Resistance (DCR): 75mΩ
R18-R21 R24-R28 R30 = 10kΩ: as R52 on sheet TF-USB
R22 R31 R32 = 100kΩ: as R57 on sheet TF-USB
R23 R29 R68 R69 = 0Ω: as R53 on sheet TF-USB
R65 = 33kΩ: 62.5mW 33kΩ 50V ±100ppm/℃ Thick Film Resistor ±1% 0402 Chip Resistor - Surface Mount ROHS
R66 = 1kΩ: 1kΩ 62.5mW 50V ±100ppm/℃ Thick Film Resistor ±1% 0402 Chip Resistor - Surface Mount ROHS
R67 = 150kΩ: 62.5mW 150kΩ 50V ±100ppm/℃ Thick Film Resistor ±1% 0402 Chip Resistor - Surface Mount ROHS
U6 = AP6212: 2.4GHz -90dBm QFN-44(12x12) RF Transceiver Modules and Modems ROHS; Manufacturer: AMPAK(正基科技); Add into BOM: yes; Interface Type: On-board PCB antenna; Output Power: 16dBm; Symbol: AP6212; Device: AP6212; LCSC Part Name: AP6212; Supplier Part: C2798300; Manufacturer Part: AP6212; Supplier Footprint: QFN-44(12x12); JLCPCB Part Class: Extended Part; Datasheet: https://item.szlcsc.com/datasheet/AP6212/2941698.html; Supplier: LCSC; Convert to PCB: yes; Utilized IC / Part: -; Wireless Standard: -; Value: 2.4GHz; Antenna Type: -; Voltage - Supply: -; Receive  Current: -; Send  Current: -; Sensitivity: -90dBm; Operating Temperature: -30℃~+85℃
U30 = SY8089A1AAC: 1.5MHz Buck 2A Adjustable 1 SOT-23-5 Voltage Regulators - DC DC Switching Regulators ROHS; Manufacturer: Silergy(矽力杰); Add into BOM: yes; Voltage - Supply: 2.5V~5.5V; Number of Outputs: 1; Quiescent Current: 50uA; Switch tube (built-in/external): Built-In; Symbol: SY8089A1AAC; Device: SY8089A1AAC; LCSC Part Name: 高效1.5MHz 2A同步降压调节器; Supplier Part: C479074; Manufacturer Part: SY8089A1AAC; Supplier Footprint: SOT-23-5; JLCPCB Part Class: Extended Part; Datasheet: https://item.szlcsc.com/datasheet/SY8089A1AAC/486366.html; Supplier: LCSC; Convert to PCB: yes; Function: Buck; Output Voltage: -; Output Current: 2A; Frequency - Switching: 1.5MHz; Operating Temperature: -40℃~+125℃@(TA/TJ); Synchronous Rectifier: Yes; Topology: Buck; Output Type: Adjustable
U31 = ME6212C18M5G: 65dB@(1kHz) Positive Fixed 1.8V SOT-23-5 Voltage Regulators - Linear, Low Drop Out (LDO) Regulators ROHS; Manufacturer: MICRONE(南京微盟); Add into BOM: yes; Voltage - Supply: 6V; Output Current: 350mA; Voltage Dropout: 200mV@(100mA); standby current: 50uA; Noise: 50uVrms; Number of Outputs: 1; Symbol: ME6212C18M5G; Device: ME6212C18M5G; LCSC Part Name: 输入6V 输出1.8V 250mA; Supplier Part: C236669; Manufacturer Part: ME6212C18M5G; Supplier Footprint: SOT-23-5; JLCPCB Part Class: Extended Part; Datasheet: https://item.szlcsc.com/datasheet/ME6212C18M5G/236109.html; Supplier: LCSC; Convert to PCB: yes; Output Type: Fixed; Output Voltage: 1.8V; Power Supply Rejection Ratio (PSRR): 65dB@(1kHz); Features: Enable; Operating Temperature: -40℃~+150℃@(Ta); Output Configuration: Positive
X1 = TAXM26M4RLBCCT2T: Crystal Oscillator 20pF SMD3225-4P Crystals ROHS; Manufacturer: YJX(雅晶鑫); Symbol: SMD-3225_4P26MHZ20PF10PPM-40~+85℃; Add into BOM: yes; Normal temperature Frequency Tolerance: ±10ppm; Frequency Stability: ±50ppm; Equivalent Series Resistance(ESR): 80Ω; Device: TAXM26M4RLBCCT2T; LCSC Part Name: 26MHz ±10ppm 20pF; Supplier Part: C164050; Manufacturer Part: TAXM26M4RLBCCT2T; Supplier Footprint: SMD3225-4P; JLCPCB Part Class: Extended Part; Datasheet: https://item.szlcsc.com/datasheet/TAXM26M4RLBCCT2T/175432.html; Supplier: LCSC; Convert to PCB: yes; Type: Crystal Oscillator; Value: 26MHz; Load Capacitance: 20pF; Operating Temperature: -40℃~+85℃

## Sheet SoC_2.SchDoc
size A3; SheetNumber: 6; SheetTotal: 10
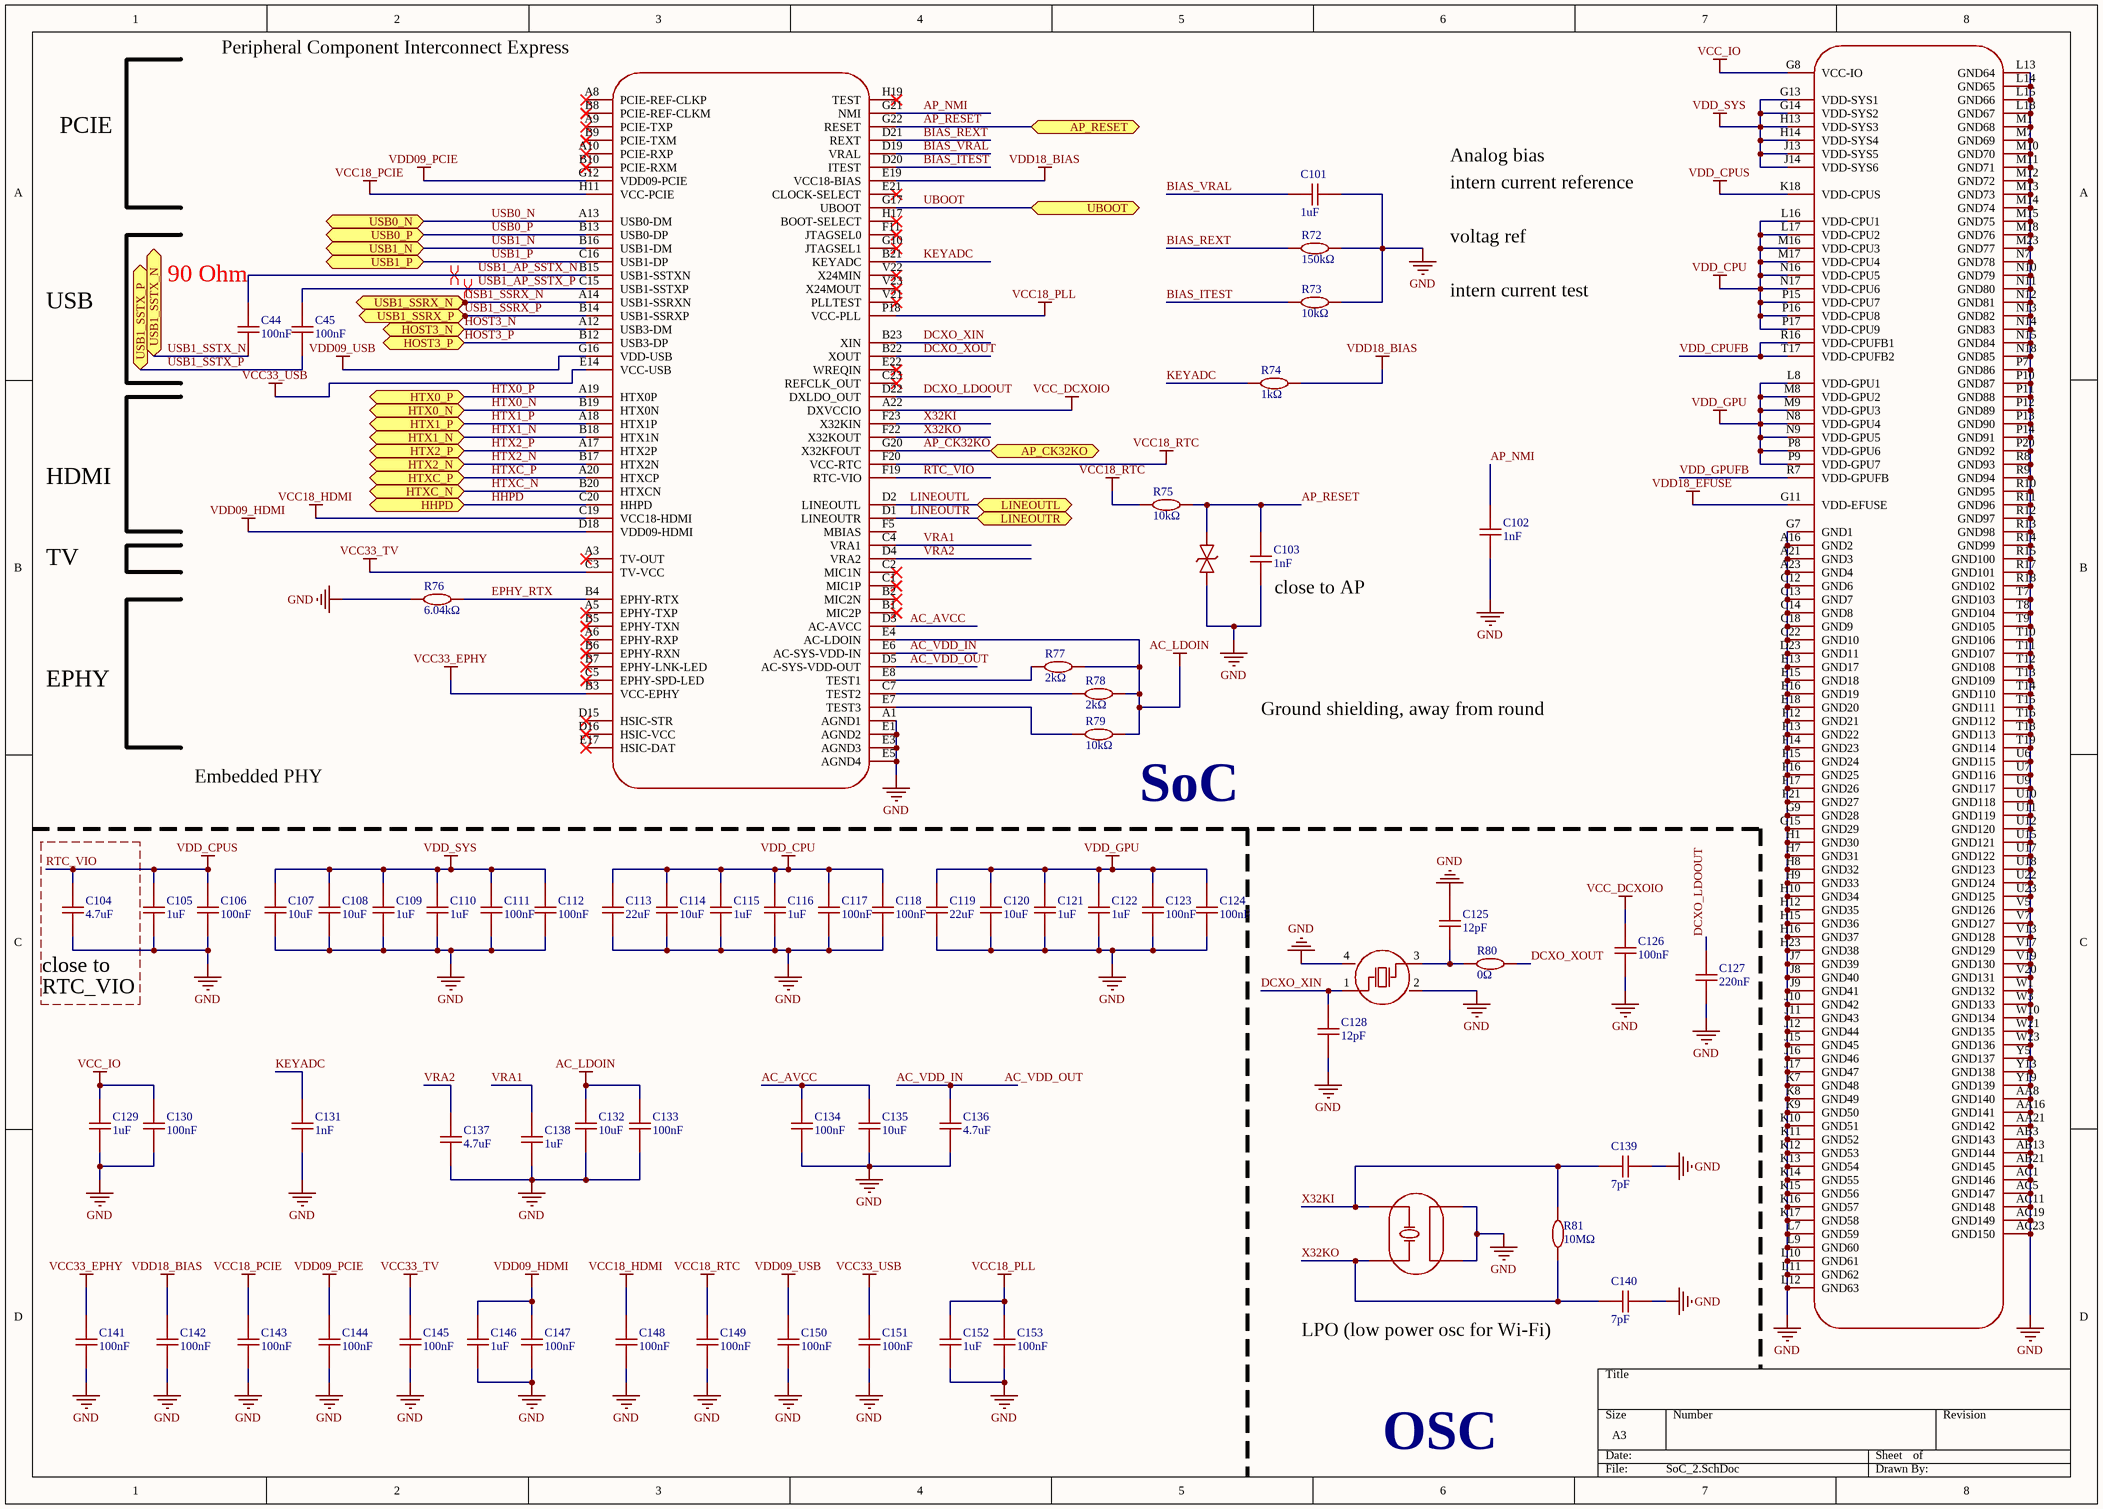
[diagram p8: SoC_2.SchDoc]

### Parts
C44  100nF  [C0402]
C45  100nF  [C0402]
C101  1uF  [C0402]
C102  1nF  [C0402]
C103  1nF  [C0402]
C104  4.7uF  [C0402]
C105  1uF  [C0402]
C106  100nF  [C0402]
C107  10uF  [C0603]
C108  10uF  [C0603]
C109  1uF  [C0402]
C110  1uF  [C0402]
C111  100nF  [C0402]
C112  100nF  [C0402]
C113  22uF  [C0603]
C114  10uF  [C0603]
C115  1uF  [C0402]
C116  1uF  [C0402]
C117  100nF  [C0402]
C118  100nF  [C0402]
C119  22uF  [C0603]
C120  10uF  [C0603]
C121  1uF  [C0402]
C122  1uF  [C0402]
C123  100nF  [C0402]
C124  100nF  [C0402]
C125  12pF  [C0402]
C126  100nF  [C0402]
C127  220nF  [C0402]
C128  12pF  [C0402]
C129  1uF  [C0402]
C130  100nF  [C0402]
C131  1nF  [C0402]
C132  10uF  [C0603]
C133  100nF  [C0402]
C134  100nF  [C0402]
C135  10uF  [C0603]
C136  4.7uF  [C0402]
C137  4.7uF  [C0402]
C138  1uF  [C0402]
C139  7pF  [C0402]
C140  7pF  [C0402]
C141  100nF  [C0402]
C142  100nF  [C0402]
C143  100nF  [C0402]
C144  100nF  [C0402]
C145  100nF  [C0402]
C146  1uF  [C0402]
C147  100nF  [C0402]
C148  100nF  [C0402]
C149  100nF  [C0402]
C150  100nF  [C0402]
C151  100nF  [C0402]
C152  1uF  [C0402]
C153  100nF  [C0402]
R72  150kΩ  [R0402]
R73  10kΩ  [R0402]
R74  1kΩ  [R0402]
R75  10kΩ  [R0402]
R76  6.04kΩ  [R0402]
R77  2kΩ  [R0402]
R78  2kΩ  [R0402]
R79  10kΩ  [R0402]
R80  0Ω  [R0402]
R81  10MΩ  [R0402]
U2  Allwinner_H6  [BGA451_ALLWINNER_H6]  (value not drawn)  (parts C,D of 4)
U32  ESD5451N  [DFN1006-2L-BI]  (value not drawn)
X2  24MHz  [CRYSTAL-SMD_4P-L3.2-W2.5-BL]  (value not drawn)
X3  32.768kHz  [MC-146_4P-L6.7-W1.5-P0.85-TL]  (value not drawn)

### Ports
AP_CK32KO (bidir, see Wi-Fi[5B]), AP_RESET (bidir, see GPIO[6C], Power[4B]), HHPD (bidir, see Audio-HDMI[4C]), HOST3_N (bidir, see TF-USB[3C]), HOST3_P (bidir, see TF-USB[3C]), HTX0_N (bidir, see Audio-HDMI[4C]), HTX0_P (bidir, see Audio-HDMI[4C]), HTX1_N (bidir, see Audio-HDMI[4C]), HTX1_P (bidir, see Audio-HDMI[4B]), HTX2_N (bidir, see Audio-HDMI[4B]), HTX2_P (bidir, see Audio-HDMI[4B]), HTXC_N (bidir, see Audio-HDMI[4C]), HTXC_P (bidir, see Audio-HDMI[4C]), LINEOUTL (bidir, see Audio-HDMI[6A]), LINEOUTR (bidir, see Audio-HDMI[6A]), UBOOT (bidir, see GPIO[6C]), USB0_N (bidir, see TF-USB[8A]), USB0_P (bidir, see TF-USB[8A]), USB1_N (bidir, see TF-USB[5C]), USB1_P (bidir, see TF-USB[5C]), USB1_SSRX_N (bidir, see SoC_2[2A], TF-USB[6C]), USB1_SSRX_P (bidir, see TF-USB[6C]), USB1_SSTX_N (bidir, see TF-USB[6C]), USB1_SSTX_P (bidir, see TF-USB[6C])

### Nets
AC_LDOIN: C132.2 C133.2 C141.2 C145.2 R77.2 R78.2 R79.1 U2.B3(VCC-EPHY) U2.C3(TV-VCC) U2.E4(AC-LDOIN)  [also labelled VCC33_EPHY, VCC33_TV]  [project net ALDO2]
GND: C101.2 C102.1 C103.1 C104.1 C105.1 C106.1 C107.1 C108.1 C109.1 C110.1 C111.1 C112.1 C113.1 C114.1 C115.1 C116.1 C117.1 C118.1 C119.1 C120.1 C121.1 C122.1 C123.1 C124.1 C125.2 C126.1 C127.1 C128.1 C129.1 C130.1 C131.1 C132.1 C133.1 C134.1 C135.1 C136.1 C137.1 C138.1 C139.2 C140.2 C141.1 C142.1 C143.1 C144.1 C145.1 C146.1 C147.1 C148.1 C149.1 C150.1 C151.1 C152.1 C153.1 R72.2 R73.2 R76.1 U2.A1(AGND1) U2.A16(GND2) U2.A21(GND3) U2.A23(GND4) U2.AA8(GND140) U2.AA16(GND141) U2.AA21(GND142) U2.AB3(GND143) U2.AB13(GND144) U2.AB21(GND145) U2.AC1(GND146) U2.AC5(GND147) U2.AC11(GND148) U2.AC19(GND149) U2.AC23(GND150) U2.C12(GND6) U2.C13(GND7) U2.C14(GND8) U2.C18(GND9) U2.C22(GND10) U2.D23(GND11) U2.E1(AGND2) U2.E3(AGND3) U2.E5(AGND4) U2.E13(GND17) U2.E15(GND18) U2.E16(GND19) U2.E18(GND20) U2.F12(GND21) U2.F13(GND22) U2.F14(GND23) U2.F15(GND24) U2.F16(GND25) U2.F17(GND26) U2.F21(GND27) U2.G7(GND1) U2.G9(GND28) U2.G15(GND29) U2.H1(GND30) U2.H7(GND31) U2.H8(GND32) U2.H9(GND33) U2.H10(GND34) U2.H12(GND35) U2.H15(GND36) U2.H16(GND37) U2.H23(GND38) U2.J7(GND39) U2.J8(GND40) U2.J9(GND41) U2.J10(GND42) U2.J11(GND43) U2.J12(GND44) U2.J15(GND45) U2.J16(GND46) U2.J17(GND47) U2.K7(GND48) U2.K8(GND49) U2.K9(GND50) U2.K10(GND51) U2.K11(GND52) U2.K12(GND53) U2.K13(GND54) U2.K14(GND55) U2.K15(GND56) U2.K16(GND57) U2.K17(GND58) U2.L7(GND59) U2.L9(GND60) U2.L10(GND61) U2.L11(GND62) U2.L12(GND63) U2.L13(GND64) U2.L14(GND65) U2.L15(GND66) U2.L18(GND67) U2.M1(GND68) U2.M7(GND69) U2.M10(GND70) U2.M11(GND71) U2.M12(GND72) U2.M13(GND73) U2.M14(GND74) U2.M15(GND75) U2.M18(GND76) U2.M23(GND77) U2.N7(GND78) U2.N10(GND79) U2.N11(GND80) U2.N12(GND81) U2.N13(GND82) U2.N14(GND83) U2.N15(GND84) U2.N18(GND85) U2.P7(GND86) U2.P10(GND87) U2.P11(GND88) U2.P12(GND89) U2.P13(GND90) U2.P14(GND91) U2.P20(GND92) U2.R8(GND93) U2.R9(GND94) U2.R10(GND95) U2.R11(GND96) U2.R12(GND97) U2.R13(GND98) U2.R14(GND99) U2.R15(GND100) U2.R17(GND101) U2.R18(GND102) U2.T7(GND103) U2.T8(GND104) U2.T9(GND105) U2.T10(GND106) U2.T11(GND107) U2.T12(GND108) U2.T13(GND109) U2.T14(GND110) U2.T15(GND111) U2.T16(GND112) U2.T18(GND113) U2.T19(GND114) U2.U6(GND115) U2.U7(GND116) U2.U9(GND117) U2.U10(GND118) U2.U11(GND119) U2.U12(GND120) U2.U15(GND121) U2.U17(GND122) U2.U18(GND123) U2.U22(GND124) U2.U23(GND125) U2.V5(GND126) U2.V7(GND127) U2.V13(GND128) U2.V17(GND129) U2.V19(GND130) U2.V20(GND131) U2.W1(GND132) U2.W3(GND133) U2.W10(GND134) U2.W21(GND135) U2.W23(GND136) U2.Y5(GND137) U2.Y13(GND138) U2.Y19(GND139) U32.1 X2.2(GND) X2.4(GND) X3.2 X3.3
RTC_VIO: C104.2 C105.2 C106.2 U2.F19(RTC-VIO) U2.K18(VDD-CPUS)  [also labelled VDD_CPUS]
VCC18_HDMI: C143.2 C148.2 U2.C19(VCC18-HDMI) U2.G11(VDD-EFUSE) U2.H11(VCC-PCIE)  [also labelled VCC18_PCIE, VDD18_EFUSE]  [project net BLDO2]
VCC18_PLL: C142.2 C152.2 C153.2 R74.2 U2.E19(VCC18-BIAS) U2.P18(VCC-PLL)  [also labelled VDD18_BIAS]  [project net BLDO1]
VCC18_RTC: C149.2 R75.1 U2.F20(VCC-RTC)
VCC33_USB: C129.2 C130.2 C151.2 U2.E14(VCC-USB) U2.G8(VCC-IO)  [also labelled VCC_IO]  [project net ALDO3]
VCC_DCXOIO: C126.2 U2.A22(DXVCCIO)
VDD09_HDMI: C107.2 C108.2 C109.2 C110.2 C111.2 C112.2 C144.2 C146.2 C147.2 C150.2 U2.D18(VDD09-HDMI) U2.G12(VDD09-PCIE) U2.G13(VDD-SYS1) U2.G14(VDD-SYS2) U2.G16(VDD-USB) U2.H13(VDD-SYS3) U2.H14(VDD-SYS4) U2.J13(VDD-SYS5) U2.J14(VDD-SYS6)  [also labelled VDD09_PCIE, VDD09_USB, VDD_SYS]
VDD_CPU: C113.2 C114.2 C115.2 C116.2 C117.2 C118.2 U2.L16(VDD-CPU1) U2.L17(VDD-CPU2) U2.M16(VDD-CPU3) U2.M17(VDD-CPU4) U2.N16(VDD-CPU5) U2.N17(VDD-CPU6) U2.P15(VDD-CPU7) U2.P16(VDD-CPU8) U2.P17(VDD-CPU9)
VDD_GPU: C119.2 C120.2 C121.2 C122.2 C123.2 C124.2 U2.L8(VDD-GPU1) U2.M8(VDD-GPU2) U2.M9(VDD-GPU3) U2.N8(VDD-GPU4) U2.N9(VDD-GPU5) U2.P8(VDD-GPU6) U2.P9(VDD-GPU7)
AC_AVCC: C134.2 C135.2 U2.D3(AC-AVCC)
AC_VDD_IN: C136.2 U2.D5(AC-SYS-VDD-OUT) U2.E6(AC-SYS-VDD-IN)  [also labelled AC_VDD_OUT]
AP_CK32KO: U2.G20(X32KFOUT) ; port AP_CK32KO
AP_NMI: C102.2 U2.G21(NMI)
AP_RESET: C103.2 R75.2 U2.G22(RESET) U32.2 ; port AP_RESET
BIAS_ITEST: R73.1 U2.D20(ITEST)
BIAS_REXT: R72.1 U2.D21(REXT)
BIAS_VRAL: C101.1 U2.D19(VRAL)
DCXO_LDOOUT: C127.2 U2.D22(DXLDO_OUT)
DCXO_XIN: C128.2 U2.B23(XIN) X2.1(OSC1)
DCXO_XOUT: R80.2 U2.B22(XOUT)
EPHY_RTX: R76.2 U2.B4(EPHY-RTX)
HHPD: U2.C20(HHPD) ; port HHPD
HOST3_N: U2.A12(USB3-DM) ; port HOST3_N
HOST3_P: U2.B12(USB3-DP) ; port HOST3_P
HTX0_N: U2.B19(HTX0N) ; port HTX0_N
HTX0_P: U2.A19(HTX0P) ; port HTX0_P
HTX1_N: U2.B18(HTX1N) ; port HTX1_N
HTX1_P: U2.A18(HTX1P) ; port HTX1_P
HTX2_N: U2.B17(HTX2N) ; port HTX2_N
HTX2_P: U2.A17(HTX2P) ; port HTX2_P
HTXC_N: U2.B20(HTXCN) ; port HTXC_N
HTXC_P: U2.A20(HTXCP) ; port HTXC_P
KEYADC: C131.2 R74.1 U2.B21(KEYADC)
LINEOUTL: U2.D2(LINEOUTL) ; port LINEOUTL
LINEOUTR: U2.D1(LINEOUTR) ; port LINEOUTR
UBOOT: U2.G17(UBOOT) ; port UBOOT
USB0_N: U2.A13(USB0-DM) ; port USB0_N
USB0_P: U2.B13(USB0-DP) ; port USB0_P
USB1_AP_SSTX_N: C44.2 U2.B15(USB1-SSTXN)
USB1_AP_SSTX_P: C45.2 U2.C15(USB1-SSTXP)
USB1_N: U2.B16(USB1-DM) ; port USB1_N
USB1_P: U2.C16(USB1-DP) ; port USB1_P
USB1_SSRX_N: U2.A14(USB1-SSRXN) ; port USB1_SSRX_N
USB1_SSRX_P: U2.B14(USB1-SSRXP) ; port USB1_SSRX_P
USB1_SSTX_N: C44.1 ; port USB1_SSTX_N
USB1_SSTX_P: C45.1 ; port USB1_SSTX_P
VDD_CPUFB: U2.R16(VDD-CPUFB1) U2.T17(VDD-CPUFB2)
VDD_GPUFB: U2.R7(VDD-GPUFB)
VRA1: C138.2 U2.C4(VRA1)
VRA2: C137.2 U2.D4(VRA2)
X32KI: C139.1 R81.2 U2.F23(X32KIN) X3.4(OSC2)
X32KO: C140.1 R81.1 U2.F22(X32KOUT) X3.1(OSC1)
NetC125_1: C125.1 R80.1 X2.3(OSC2)
NetR77_1: R77.1 U2.E8(TEST1)
NetR78_1: R78.1 U2.C7(TEST2)
NetR79_2: R79.2 U2.E7(TEST3)

Not connected (* = marked no-connect by the designer): U2 A3(TV-OUT)* A5(EPHY-TXP)* A6(EPHY-RXP)* A8(PCIE-REF-CLKP)* A9(PCIE-TXP)* A10(PCIE-RXP)* B1(MIC2P)* B2(MIC2N)* B5(EPHY-TXN)* B6(EPHY-RXN)* B7(EPHY-LNK-LED)* B8(PCIE-REF-CLKM)* B9(PCIE-TXM)* B10(PCIE-RXM)* C1(MIC1P)* C2(MIC1N)* C5(EPHY-SPD-LED)* C23(REFCLK_OUT)* D15(HSIC-STR)* D16(HSIC-VCC)* E17(HSIC-DAT)* E21(CLOCK-SELECT)* E22(WREQIN)* F5(MBIAS) F11(JTAGSEL0)* G10(JTAGSEL1)* H17(BOOT-SELECT)* H19(TEST)* V21(PLLTEST)* V22(X24MIN)* V23(X24MOUT)*

### Layout directives
differential pair: USB1_AP_SSTX_N, USB1_AP_SSTX_P

### Notes on the sheet
- (near U2) Peripheral Component Interconnect Express
- PCIE
- Analog bias
- intern current reference
- voltag ref
- USB
- (near C44) 90 Ohm
- intern current test
- HDMI
- TV
- (near C103) close to AP
- EPHY
- Ground shielding, away from round
- Embedded PHY
- (near R79) SoC
- close to
- RTC_VIO
- (near C140) LPO (low power osc for Wi-Fi)
- OSC

### Library data of the parts
C44 C45 C106 C111 C112 C117 C118 C123 C124 C126 C130 C133 C134 C141-C145 C147-C151 C153 = 100nF: as C81 on sheet TF-USB
C101 C105 C109 C110 C115 C116 C121 C122 C129 C138 C146 C152 = 1uF: as C89 on sheet Wi-Fi
C102 C103 C131 = 1nF: 50V 1nF X7R ±10% 0402 Ceramic Capacitors ROHS
C104 C136 C137 = 4.7uF: as C33 on sheet Audio-HDMI
C107 C108 C114 C120 C132 C135 = 10uF: as C82 on sheet TF-USB
C113 C119 = 22uF: 16V 22uF X5R ±20% 0603 Ceramic Capacitors ROHS
C125 C128 = 12pF: 50V 12pF C0G ±5% 0402 Ceramic Capacitors ROHS
C127 = 220nF: 16V 220nF X7R ±10% 0402 Ceramic Capacitors ROHS
C139 C140 = 7pF: 50V 7pF NP0 0402 Ceramic Capacitors ROHS
R72 = 150kΩ: as R67 on sheet Wi-Fi
R73 R75 R79 = 10kΩ: as R52 on sheet TF-USB
R74 = 1kΩ: as R66 on sheet Wi-Fi
R76 = 6.04kΩ: 6.04kΩ 62.5mW 50V ±100ppm/℃ Thick Film Resistor ±1% 0402 Chip Resistor - Surface Mount ROHS
R77 R78 = 2kΩ: 100mW 2kΩ 75V ±100ppm/℃ Thick Film Resistor ±1% 0402 Chip Resistor - Surface Mount ROHS
R80 = 0Ω: as R53 on sheet TF-USB
R81 = 10MΩ: 62.5mW 10MΩ 50V ±100ppm/℃ Thick Film Resistor ±1% 0402 Chip Resistor - Surface Mount ROHS
U2 = Allwinner_H6: Add into BOM: yes; Symbol: Allwinner_H6; Device: Allwinner_H6; Convert to PCB: yes
U32 = ESD5451N_C5261080: as U14 on sheet TF-USB; Symbol: ESD5451N_C5261080; Device: ESD5451N_C5261080; LCSC Part Name: 5V 15pF 双向; Supplier Part: C5261080; Manufacturer Part: ESD5451N; Supplier Footprint: DFN1006-2L; JLCPCB Part Class: Extended Part; Datasheet: https://item.szlcsc.com/datasheet/ESD5451N/5983779.html; Supplier: LCSC; Convert to PCB: yes; Polarity: Bidirectional; Reverse Stand-Off Voltage (Vrwm): 5V; Clamping Voltage: 9.8V; Peak Pulse Current (Ipp): 9A; Voltage - Breakdown: 8V; Type: ESD
X2 = X322524MOB4SI: Crystal Oscillator 12pF SMD3225-4P Crystals ROHS; Manufacturer: YXC(扬兴晶振); Add into BOM: yes; Normal temperature Frequency Tolerance: ±10ppm; Frequency Stability: ±20ppm; Symbol: X322524MOB4SI; Device: X322524MOB4SI; LCSC Part Name: YSX321SL 24MHZ 4P 3225 12PF ±10PPM -40~85℃ (±20PPM); Supplier Part: C70590; Manufacturer Part: X322524MOB4SI; Supplier Footprint: SMD3225-4P; JLCPCB Part Class: Extended Part; Datasheet: https://item.szlcsc.com/datasheet/X322524MOB4SI/71688.html; Supplier: LCSC; Convert to PCB: yes; Type: Surface Mount Crystal; Value: 24MHz; Load Capacitance: 12pF; Operating Temperature: -40℃~+85℃
X3 = Q13MC14610001: Crystal Oscillator 7pF MC-146 Crystals ROHS; Manufacturer: EPSON(爱普生); Symbol: MC-14632.768kHz7.0pF20PPM; Add into BOM: yes; Normal temperature Frequency Tolerance: ±20ppm; Equivalent Series Resistance(ESR): 65kΩ; Device: Q13MC14610001; LCSC Part Name: 32.768kHz ±20ppm 7pF; Supplier Part: C94977; Manufacturer Part: Q13MC14610001; Supplier Footprint: MC-146; JLCPCB Part Class: Extended Part; Datasheet: https://atta.szlcsc.com/upload/public/pdf/source/20170211/1486785670215.pdf; Supplier: LCSC; Convert to PCB: yes; Type: Surface Mount Crystal; Value: 32.768kHz; Operating Temperature: -40℃~+85℃

## Sheet GPIO.SchDoc
size A3; SheetNumber: 10; SheetTotal: 10
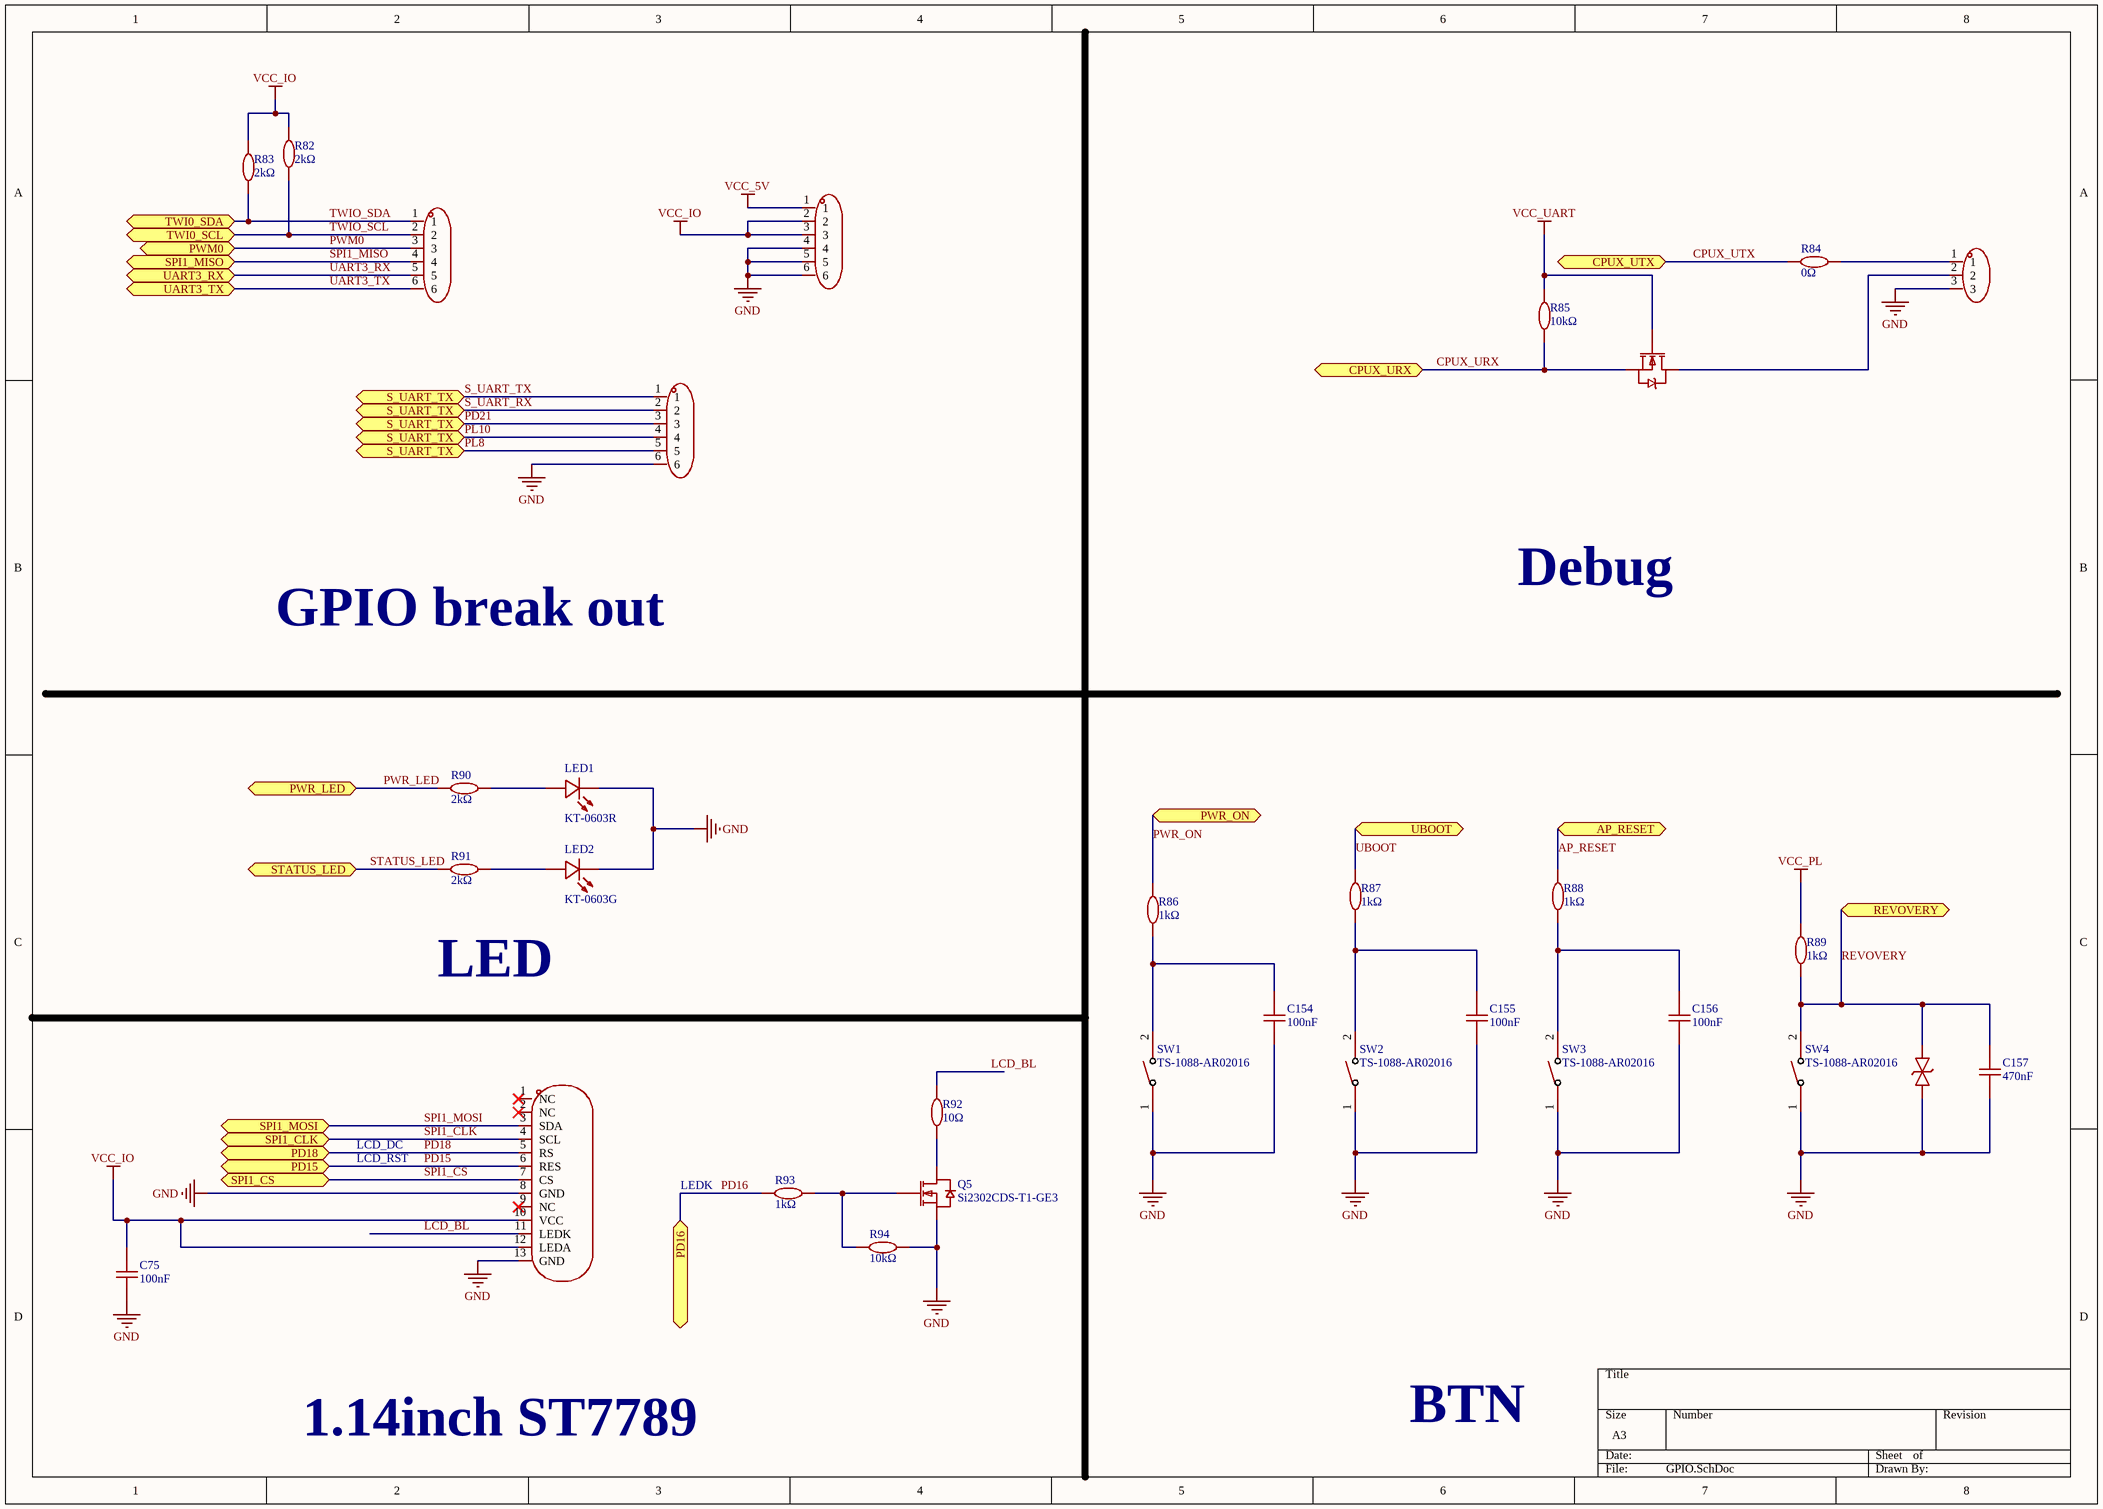
[diagram p9: GPIO.SchDoc]

### Parts
C75  100nF  [C0402]
C154  100nF  [C0402]
C155  100nF  [C0402]
C156  100nF  [C0402]
C157  470nF  [C0402]
H2  HX PZ2.54-1x3P ZZ  [CONN-TH_HX-PZ2.54-1X3P-ZZ]  (value not drawn)
LCD1  N099-0416THBIG01-H10  [LCD-SMD_10P-P0.70-L44.8-W8.6_N099-0416THBIG01-H10]  (value not drawn)
LED1  KT-0603R  [LED0603-RD]
LED2  KT-0603G  [LED0603-GR]
Q4  BSN20  [SOT-23-3_L2.9-W1.6-P1.90-LS2.8-BR]  (value not drawn)
Q5  Si2302CDS-T1-GE3  [SOT-23_L2.9-W1.3-P1.90-LS2.4-BR]
R82  2kΩ  [R0402]
R83  2kΩ  [R0402]
R84  0Ω  [R0402]
R85  10kΩ  [R0402]
R86  1kΩ  [R0402]
R87  1kΩ  [R0402]
R88  1kΩ  [R0402]
R89  1kΩ  [R0402]
R90  2kΩ  [R0402]
R91  2kΩ  [R0402]
R92  10Ω  [R0402]
R93  1kΩ  [R0402]
R94  10kΩ  [R0402]
SW1  TS-1088-AR02016  [SW-SMD_L3.9-W3.0-P4.45]
SW2  TS-1088-AR02016  [SW-SMD_L3.9-W3.0-P4.45]
SW3  TS-1088-AR02016  [SW-SMD_L3.9-W3.0-P4.45]
SW4  TS-1088-AR02016  [SW-SMD_L3.9-W3.0-P4.45]
U12  HX PZ2.54-1x6P ZZ  [HDR-TH_6P-P2.54-V-M]  (value not drawn)
U33  HX PZ2.54-1x6P ZZ  [HDR-TH_6P-P2.54-V-M]  (value not drawn)
U34  HX PZ2.54-1x6P ZZ  [HDR-TH_6P-P2.54-V-M]  (value not drawn)
U35  ESD5451N  [DFN1006-2L-BI]  (value not drawn)

### Ports
AP_RESET (bidir, see Power[4B], SoC_2[4A]), CPUX_URX (bidir, see SoC_1[6B]), CPUX_UTX (bidir, see SoC_1[6B]), PD15 (bidir, see SoC_1[2B]), PD16 (bidir, see SoC_1[2C]), PD18 (bidir, see SoC_1[2C]), PWM0 (bidir, see SoC_1[2C]), PWR_LED (bidir, see SoC_1[6C]), PWR_ON (bidir, see Power[4B]), REVOVERY (bidir, see SoC_1[6C]), S_UART_TX (bidir, see GPIO[2B], SoC_1[6C]), SPI1_CLK (bidir, see SoC_1[6B]), SPI1_CS (bidir, see SoC_1[6B]), SPI1_MISO (bidir, see SoC_1[6B]), SPI1_MOSI (bidir, see SoC_1[6B]), STATUS_LED (bidir, see SoC_1[6C]), TWI0_SCL (bidir, see SoC_1[2C]), TWI0_SDA (bidir, see SoC_1[2C]), UART3_RX (bidir, see SoC_1[2C]), UART3_TX (bidir, see SoC_1[2C]), UBOOT (bidir, see SoC_2[4A])

### Nets
GND: C75.1 C154.1 C155.1 C156.1 C157.1 H2.3 LCD1.8(GND) LCD1.13(GND) LED1.1(K) LED2.1(K) Q5.2(S) R94.2 SW1.1 SW2.1 SW3.1 SW4.1 U12.4 U12.5 U12.6 U34.6 U35.1
VCC_5V: U12.1  [project net PS]
VCC_IO: C75.2 LCD1.10(VCC) LCD1.12(LEDA) Q4.1(G) R82.2 R83.2 R85.2 U12.2 U12.3  [also labelled VCC_UART]  [project net ALDO3]
VCC_PL: R89.2  [project net ALDO1]
AP_RESET: R88.2 ; port AP_RESET
CPUX_URX: Q4.2(S) R85.1 ; port CPUX_URX
CPUX_UTX: R84.1 ; port CPUX_UTX
LCD_BL: LCD1.11(LEDK) R92.2
PD15: LCD1.6(RES) ; port PD15
PD16: R93.2 ; port PD16
PD18: LCD1.5(RS) ; port PD18
PD21: U34.1 U34.2 U34.3 U34.4 U34.5 ; port S_UART_TX  [also labelled PL10, PL8, S_UART_RX, S_UART_TX]
PWM0: U33.3 ; port PWM0
PWR_LED: R90.1 ; port PWR_LED
PWR_ON: R86.2 ; port PWR_ON
REVOVERY: C157.2 R89.1 SW4.2 U35.2 ; port REVOVERY
SPI1_CLK: LCD1.4(SCL) ; port SPI1_CLK
SPI1_CS: LCD1.7(CS) ; port SPI1_CS
SPI1_MISO: U33.4 ; port SPI1_MISO
SPI1_MOSI: LCD1.3(SDA) ; port SPI1_MOSI
STATUS_LED: R91.1 ; port STATUS_LED
TWIO_SCL: R82.1 U33.2 ; port TWI0_SCL
TWIO_SDA: R83.1 U33.1 ; port TWI0_SDA
UART3_RX: U33.5 ; port UART3_RX
UART3_TX: U33.6 ; port UART3_TX
UBOOT: R87.2 ; port UBOOT
NetC154_2: C154.2 R86.1 SW1.2
NetC155_2: C155.2 R87.1 SW2.2
NetC156_2: C156.2 R88.1 SW3.2
NetH2_1: H2.1 R84.2
NetH2_2: H2.2 Q4.3(D)
NetLED1_2: LED1.2(A) R90.2
NetLED2_2: LED2.2(A) R91.2
NetQ5_1: Q5.1(G) R93.1 R94.1
NetQ5_3: Q5.3(D) R92.1

Not connected (* = marked no-connect by the designer): LCD1 1(NC)* 2(NC)* 9(NC)*

### Notes on the sheet
- GPIO break out
- Debug
- LED
- LCD_DC
- LCD_RST
- LEDK
- 1.14inch ST7789
- BTN

### Library data of the parts
C75 C154-C156 = 100nF: as C81 on sheet TF-USB
C157 = 470nF: 25V 470nF X5R ±10% 0402 Ceramic Capacitors ROHS
H2 = HX PZ2.54-1x3P ZZ: Manufacturer: hanxia(韩下); Add into BOM: yes; Pin Structure: 1x3P; Pitch: 2.54mm; Circluar Pins/Square Pins: Pin Header; Current Rating: 3A; Voltage Rating (Max): 1kV; Symbol: HX PZ2.54-1X3P ZZ; Device: HX PZ2.54-1x3P ZZ; LCSC Part Name: 1x3P 间距:2.54mm 方针 直插; Supplier Part: C32713269; Manufacturer Part: HX PZ2.54-1x3P ZZ; Supplier Footprint: 插件,P=2.54mm; JLCPCB Part Class: Extended Part; Datasheet: https://item.szlcsc.com/datasheet/HX%2520PZ2.54-1x3P%2520ZZ/34444549.html; Supplier: LCSC; Convert to PCB: yes; Row Spacing: -; Mounting Type: Through Hole; Number of Rows: 1; Number of Pins: 3P; Length of Mating Pin: 6mm; Insulation Height: 2.5mm; Length of End Connection Pin: 3mm; Contact Material: Brass; Contact Plating: Gold; Operating Temperature: -40℃~+105℃; Color: Black; Supplementary Features: -
LCD1 = N099-0416THBIG01-H10: 1.14inch ST7789 135x240 2 LCD, OLED, Graphic ROHS; Manufacturer: Wisevision(新智景); Add into BOM: yes; Dot Pixels: 160x40; Symbol: N099-0416THBIG01-H10; Device: N099-0416THBIG01-H10; LCSC Part Name: 0.99寸 彩色 40x160像素分辨率 焊接10PIN; Supplier Part: C5123574; Manufacturer Part: N099-0416THBIG01-H10; Supplier Footprint: -; JLCPCB Part Class: Extended Part; Datasheet: https://item.szlcsc.com/datasheet/N099-0416THBIG01-H10/5717767.html; Supplier: LCSC; Convert to PCB: yes; Size: 0.99
LED1 = KT-0603R: 25mA 1.8V~2.4V Red 0603 LED Indication - Discrete ROHS
LED2 = KT-0603G: Green 0603 LED Indication - Discrete ROHS
Q4 = BSN20_C116157: as Q1 on sheet Audio-HDMI; Symbol: BSN20; Device: BSN20_C116157; LCSC Part Name: 1个N沟道 耐压:50V 电流:0.1A; Supplier Part: C116157; Manufacturer Part: BSN20; Supplier Footprint: SOT-23; JLCPCB Part Class: Extended Part; Datasheet: https://item.szlcsc.com/datasheet/BSN20/117410.html; Supplier: LCSC; Convert to PCB: yes; Drain to Source Voltage: 50V; Current - Continuous Drain(Id): 100mA; RDS(on): 10Ω@2.75V,0.2A; Pd - Power Dissipation: -; Gate Threshold Voltage (Vgs(th)): 1.5V@250uA
R82 R83 R90 R91 = 2kΩ: as R77 on sheet SoC_2
R84 = 0Ω: as R53 on sheet TF-USB
R85 R94 = 10kΩ: as R52 on sheet TF-USB
R86-R89 R93 = 1kΩ: as R66 on sheet Wi-Fi
R92 = 10Ω: 10Ω 62.5mW 50V ±200ppm/℃ Thick Film Resistor ±1% 0402 Chip Resistor - Surface Mount ROHS
SW1-SW4 = TS-1088-AR02016: Without Bracket 4mm 12V 3mm Round Button SPST 50mA SMD,4x3mm Tactile Switches ROHS
U12 U33 U34 = HX PZ2.54-1x6P ZZ: 6P 1x6P Gold Brass -40℃~+105℃ Black Pin Header 2.54mm 2.5mm 6mm 1kV 3mm 3A 1 Through Hole Through Hole,P=2.54mm Headers, Male Pins ROHS; Manufacturer: hanxia(韩下); Add into BOM: yes; Symbol: HX PZ2.54-1X6P ZZ; Device: HX PZ2.54-1x6P ZZ; LCSC Part Name: 1x6P 间距:2.54mm 方针 直插; Supplier Part: C32713272; Manufacturer Part: HX PZ2.54-1x6P ZZ; Supplier Footprint: 插件,P=2.54mm; JLCPCB Part Class: Extended Part; Datasheet: https://item.szlcsc.com/datasheet/HX%2520PZ2.54-1x6P%2520ZZ/34444552.html; Supplier: LCSC; Convert to PCB: yes; Pin Structure: 1x6P; Pitch: 2.54mm; Row Spacing: -; Circluar Pins/Square Pins: Pin Header; Mounting Type: Through Hole; Number of Rows: 1; Number of Pins: 6P; Current Rating: 3A; Voltage Rating (Max): 1kV; Length of Mating Pin: 6mm; Insulation Height: 2.5mm; Length of End Connection Pin: 3mm; Contact Material: Brass; Contact Plating: Gold; Operating Temperature: -40℃~+105℃; Color: Black; Supplementary Features: -
U35 = ESD5451N_C5261080: as U14 on sheet TF-USB; Symbol: ESD5451N_C5261080; Device: ESD5451N_C5261080; LCSC Part Name: 5V 15pF 双向; Supplier Part: C5261080; Manufacturer Part: ESD5451N; Supplier Footprint: DFN1006-2L; JLCPCB Part Class: Extended Part; Datasheet: https://item.szlcsc.com/datasheet/ESD5451N/5983779.html; Supplier: LCSC; Convert to PCB: yes; Polarity: Bidirectional; Reverse Stand-Off Voltage (Vrwm): 5V; Clamping Voltage: 9.8V; Peak Pulse Current (Ipp): 9A; Voltage - Breakdown: 8V; Type: ESD